# EAGLE schematic dt-rev-b (EAGLE 9.6.2)

## Sheet 1 of 4
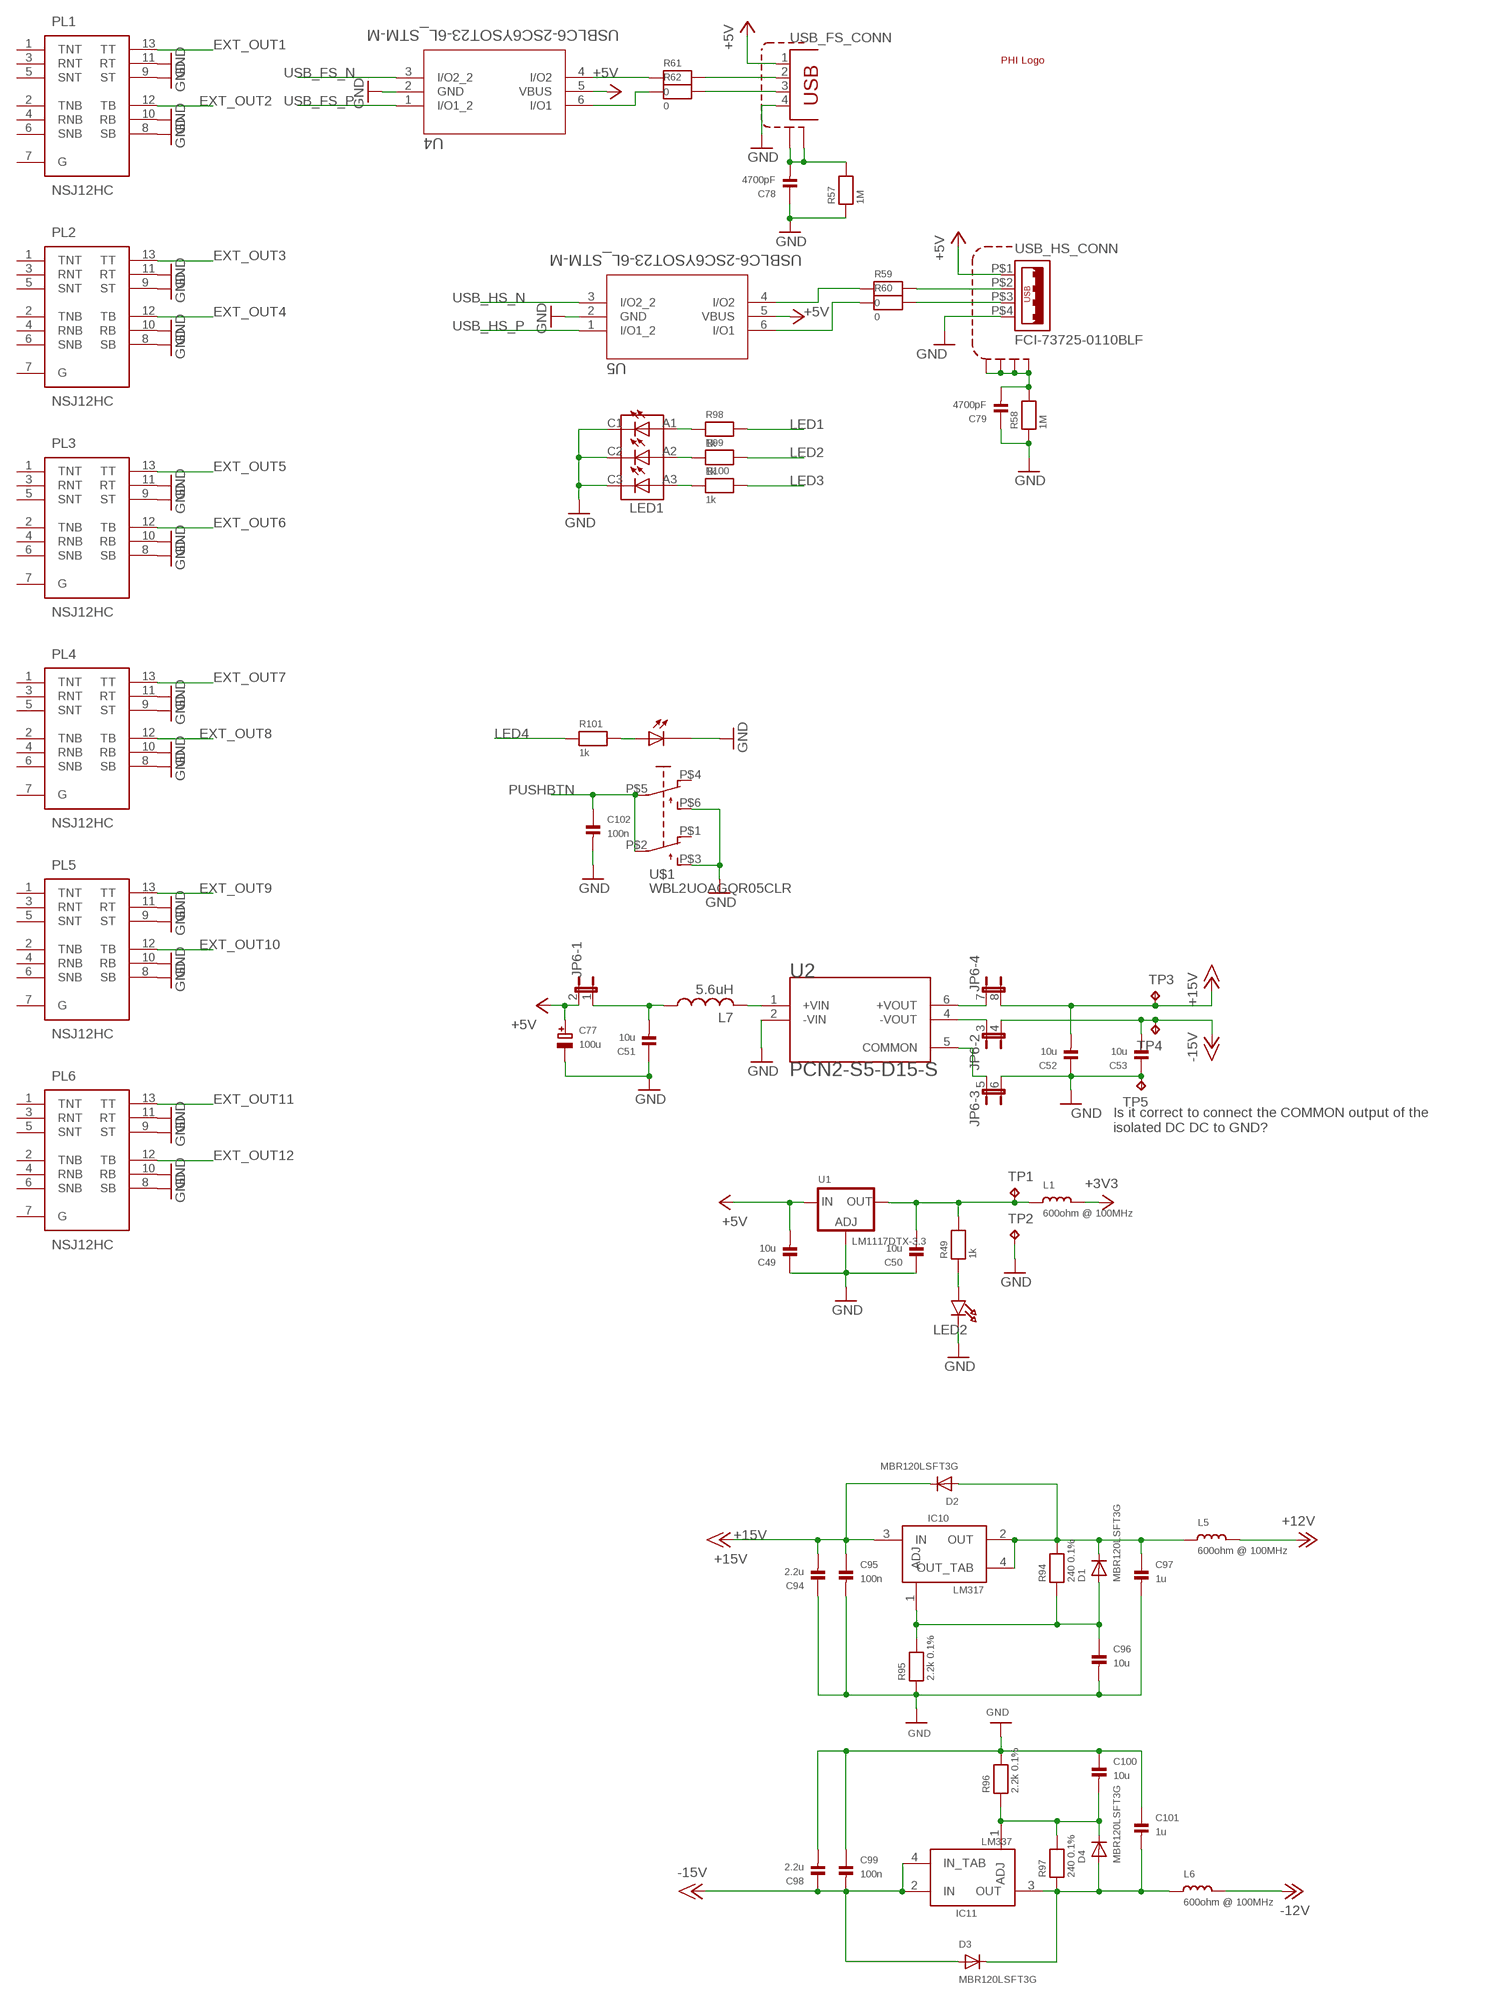
[diagram p0: schematic, sheet 1]

### Parts
C49  10u  CAP_CERAMIC0805  [0805]
C50  10u  CAP_CERAMIC0805  [0805]
C51  10u  CAP_CERAMIC0805  [0805]
C52  10u  CAP_CERAMIC0805  [0805]
C53  10u  CAP_CERAMIC0805  [0805]
C77  100u  CAP_ELECTROLYTICPANASONIC_D  [PANASONIC_D]
C78  4700pF  CAP_CERAMIC0603  [0603]
C79  4700pF  CAP_CERAMIC0603  [0603]
C94  2.2u  CAP_CERAMIC0805  [0805]
C95  100n  CAP_CERAMIC0603  [0603]
C96  10u  CAP_CERAMIC0805  [0805]
C97  1u  CAP_CERAMIC1206  [1206]
C98  2.2u  CAP_CERAMIC0805  [0805]
C99  100n  CAP_CERAMIC0603  [0603]
C100  10u  CAP_CERAMIC0805  [0805]
C101  1u  CAP_CERAMIC1206  [1206]
C102  100n  CAP_CERAMIC0603  [0603]
D1  MBR120LSFT3G  DIODESOD-123  [SOD-123]
D2  MBR120LSFT3G  DIODESOD-123  [SOD-123]
D3  MBR120LSFT3G  DIODESOD-123  [SOD-123]
D4  MBR120LSFT3G  DIODESOD-123  [SOD-123]
IC10  LM317  [SOT223]
IC11  LM337  [SOT223]
JP6  JP4QE  [JP4Q]
L1  600ohm @ 100MHz  INDUCTOR0603  [0603]
L5  600ohm @ 100MHz  INDUCTOR0603  [0603]
L6  600ohm @ 100MHz  INDUCTOR0603  [0603]
L7  5.6uH  L-USL1812  [L1812]
LED1  WP934SA_LILYLGDLED  [WP934SALILYLGD]
LED2  LED0805  [CHIPLED_0805]
PL1  NSJ12HC  NSJ12HF-1  [NSJ12HF1]
PL2  NSJ12HC  NSJ12HF-1  [NSJ12HF1]
PL3  NSJ12HC  NSJ12HF-1  [NSJ12HF1]
PL4  NSJ12HC  NSJ12HF-1  [NSJ12HF1]
PL5  NSJ12HC  NSJ12HF-1  [NSJ12HF1]
PL6  NSJ12HC  NSJ12HF-1  [NSJ12HF1]
R49  1k  RESISTOR0603  [0603]
R57  1M  RESISTOR0603  [0603]
R58  1M  RESISTOR0603  [0603]
R59  0  RESISTOR0603  [0603]
R60  0  RESISTOR0603  [0603]
R61  0  RESISTOR0603  [0603]
R62  0  RESISTOR0603  [0603]
R94  240 0.1%  RESISTOR0603  [0603]
R95  2.2k 0.1%  RESISTOR0603  [0603]
R96  2.2k 0.1%  RESISTOR0603  [0603]
R97  240 0.1%  RESISTOR0603  [0603]
R98  1k  RESISTOR0603  [0603]
R99  1k  RESISTOR0603  [0603]
R100  1k  RESISTOR0603  [0603]
R101  1k  RESISTOR0603  [0603]
TP1  TPPAD1-13  [P1-13]
TP2  TPPAD1-13  [P1-13]
TP3  TPPAD1-13  [P1-13]
TP4  TPPAD1-13  [P1-13]
TP5  TPPAD1-13  [P1-13]
U1  LM1117DTX-3.3  LM1117TO252  [TO252]
U2  PCN2-S5-D15-S  PCN2-S5-D12-S  [CONV_PCN2-S5-D12-S]
U4  USBLC6-2SC6YSOT23-6L_STM-M  [SOT23-6L_STM-M]
U5  USBLC6-2SC6YSOT23-6L_STM-M  [SOT23-6L_STM-M]
U$1  WBL2UOAGQR05CLR  [WBL2UOAGQ]
U$2  PHI-LOGO  [PHI-LOGO]
USB_FS  TE-292304-1  [TE-292304-1]
USB_HS  FCI-73725-0110BLF  [FCI-73725-0110BLF]

### Nets
+3V3: L1.2 ; also sheet 3,4
+5V: C49.2 C77.+ JP6.2 U1.2(IN) U4.5(VBUS) U5.5(VBUS) USB_FS.1 USB_HS.P$1 ; also sheet 3,4
+12V: L5.2 ; also sheet 2
+15V: C52.2 C94.2 C95.1 D2.C IC10.3(IN) JP6.8 TP3.TP
-12V: L6.2 ; also sheet 2
-15V: C53.2 C98.1 C99.2 D3.A IC11.2(IN) IC11.4(IN_TAB) JP6.4 TP4.TP
EXT_OUT1: PL1.13(TT) ; also sheet 2
EXT_OUT2: PL1.12(TB) ; also sheet 2
EXT_OUT3: PL2.13(TT) ; also sheet 2
EXT_OUT4: PL2.12(TB) ; also sheet 2
EXT_OUT5: PL3.13(TT) ; also sheet 2
EXT_OUT6: PL3.12(TB) ; also sheet 2
EXT_OUT7: PL4.13(TT) ; also sheet 2
EXT_OUT8: PL4.12(TB) ; also sheet 2
EXT_OUT9: PL5.13(TT) ; also sheet 2
EXT_OUT10: PL5.12(TB) ; also sheet 2
EXT_OUT11: PL6.13(TT) ; also sheet 2
EXT_OUT12: PL6.12(TB) ; also sheet 2
GND: C49.1 C50.1 C51.1 C52.1 C53.1 C77.- C78.1 C79.1 C94.1 C95.2 C96.2 C97.2 C98.2 C99.1 C100.1 C101.1 C102.2 JP6.6 LED1.C1(K_1) LED1.C2(K_2) LED1.C3(K_3) LED2.C PL1.8(SB) PL1.9(ST) PL1.10(RB) PL1.11(RT) PL2.8(SB) PL2.9(ST) PL2.10(RB) PL2.11(RT) PL3.8(SB) PL3.9(ST) PL3.10(RB) PL3.11(RT) PL4.8(SB) PL4.9(ST) PL4.10(RB) PL4.11(RT) PL5.8(SB) PL5.9(ST) PL5.10(RB) PL5.11(RT) PL6.8(SB) PL6.9(ST) PL6.10(RB) PL6.11(RT) R57.1 R58.1 R95.1 R96.2 TP2.TP TP5.TP U1.1(ADJ) U2.2(-VIN) U4.2(GND) U5.2(GND) U$1.LED- U$1.P$3(OUT1_NO) U$1.P$6(OUT2_NO) USB_FS.4 USB_HS.P$4 ; also sheet 2,3,4
LED1: R98.2 ; also sheet 3
LED2: R99.2 ; also sheet 3
LED3: R100.2 ; also sheet 3
LED4: R101.1 ; also sheet 3
N$49: LED2.A R49.1
N$50: C50.2 L1.1 R49.2 TP1.TP U1.3(OUT)
N$52: L7.2 U2.1(+VIN)
N$53: JP6.5 U2.5(COMMON)
N$54: JP6.7 U2.6(+VOUT)
N$55: JP6.3 U2.4(-VOUT)
N$56: C51.2 JP6.1 L7.1
N$67: C78.2 R57.2 USB_FS.P$1(SHIELD:S1) USB_FS.P$2(SHIELD:S2)
N$69: C79.2 R58.2 USB_HS.M1(SHIELD:S1) USB_HS.M2(SHIELD:S2) USB_HS.M3(SHIELD:S3) USB_HS.M4(SHIELD:S4)
N$72: C97.1 D1.C D2.A IC10.2(OUT) IC10.4(OUT_TAB) L5.1 R94.2
N$73: C96.1 D1.A IC10.1(ADJ) R94.1 R95.2
N$87: C101.2 D3.C D4.A IC11.3(OUT) L6.1 R97.1
N$88: C100.2 D4.C IC11.1(ADJ) R96.1 R97.2
N$96: LED1.A2(A_2) R99.1
N$119: LED1.A3(A_3) R100.1
N$120: LED1.A1(A_1) R98.1
N$121: R101.2 U$1.LED+
PUSHBTN: C102.1 U$1.P$2(IN1) U$1.P$5(IN2) ; also sheet 3
USB_DEV_CONN_N [USB]: R61.2 USB_FS.2
USB_DEV_CONN_P [USB]: R62.2 USB_FS.3
USB_DEV_N [USB]: R61.1 U4.4(I/O2)
USB_DEV_P [USB]: R62.1 U4.6(I/O1)
USB_FS_N [USB]: U4.3(I/O2_2) ; also sheet 3
USB_FS_P [USB]: U4.1(I/O1_2) ; also sheet 3
USB_HOST_CONN_N [USB]: R59.2 USB_HS.P$2
USB_HOST_CONN_P [USB]: R60.2 USB_HS.P$3
USB_HOST_N [USB]: R59.1 U5.4(I/O2)
USB_HOST_P [USB]: R60.1 U5.6(I/O1)
USB_HS_N [USB]: U5.3(I/O2_2) ; also sheet 3
USB_HS_P [USB]: U5.1(I/O1_2) ; also sheet 3
Unconnected: PL1.1(TNT) PL1.2(TNB) PL1.3(RNT) PL1.4(RNB) PL1.5(SNT) PL1.6(SNB) PL1.7(G) PL2.1(TNT) PL2.2(TNB) PL2.3(RNT) PL2.4(RNB) PL2.5(SNT) PL2.6(SNB) PL2.7(G) PL3.1(TNT) PL3.2(TNB) PL3.3(RNT) PL3.4(RNB) PL3.5(SNT) PL3.6(SNB) PL3.7(G) PL4.1(TNT) PL4.2(TNB) PL4.3(RNT) PL4.4(RNB) PL4.5(SNT) PL4.6(SNB) PL4.7(G) PL5.1(TNT) PL5.2(TNB) PL5.3(RNT) PL5.4(RNB) PL5.5(SNT) PL5.6(SNB) PL5.7(G) PL6.1(TNT) PL6.2(TNB) PL6.3(RNT) PL6.4(RNB) PL6.5(SNT) PL6.6(SNB) PL6.7(G) U$1.P$1(OUT1_NC) U$1.P$4(OUT2_NC)

### Notes on the sheet
- Is it correct to connect the COMMON output of the
  isolated DC DC to GND?

## Sheet 2 of 4
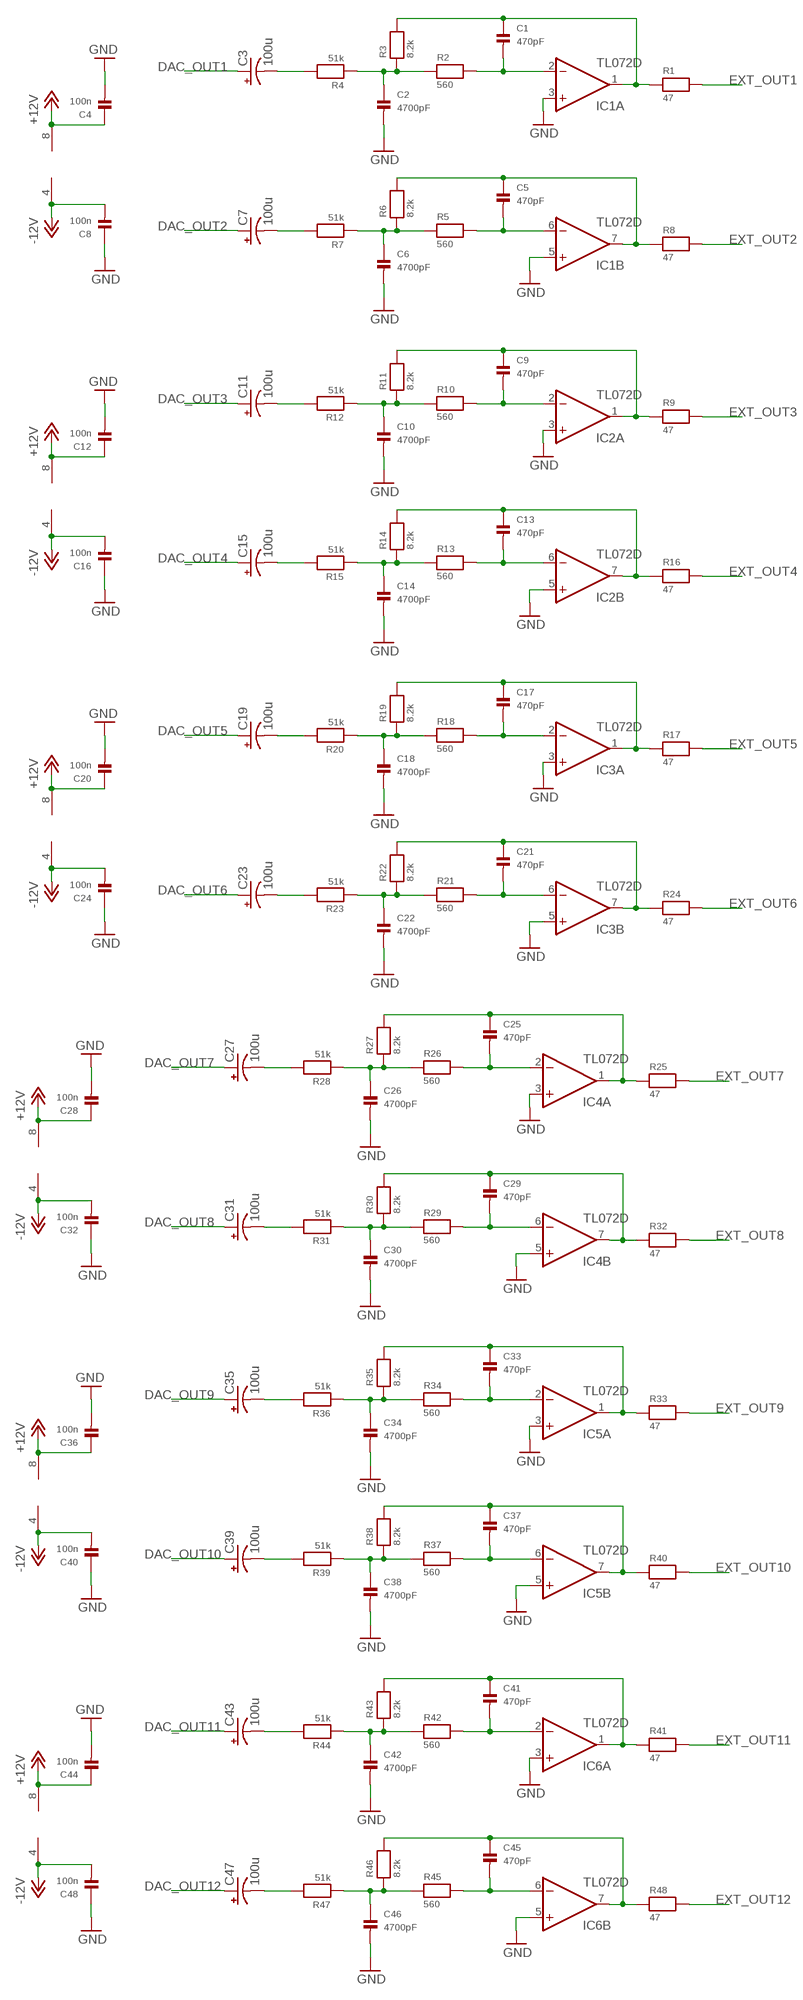
[diagram p1: schematic, sheet 2]

### Parts
C1  470pF  CAP_CERAMIC0603  [0603]
C2  4700pF  CAP_CERAMIC0603  [0603]
C3  100u  CPOL-USE2-5  [E2-5]
C4  100n  CAP_CERAMIC0603  [0603]
C5  470pF  CAP_CERAMIC0603  [0603]
C6  4700pF  CAP_CERAMIC0603  [0603]
C7  100u  CPOL-USE2-5  [E2-5]
C8  100n  CAP_CERAMIC0603  [0603]
C9  470pF  CAP_CERAMIC0603  [0603]
C10  4700pF  CAP_CERAMIC0603  [0603]
C11  100u  CPOL-USE2-5  [E2-5]
C12  100n  CAP_CERAMIC0603  [0603]
C13  470pF  CAP_CERAMIC0603  [0603]
C14  4700pF  CAP_CERAMIC0603  [0603]
C15  100u  CPOL-USE2-5  [E2-5]
C16  100n  CAP_CERAMIC0603  [0603]
C17  470pF  CAP_CERAMIC0603  [0603]
C18  4700pF  CAP_CERAMIC0603  [0603]
C19  100u  CPOL-USE2-5  [E2-5]
C20  100n  CAP_CERAMIC0603  [0603]
C21  470pF  CAP_CERAMIC0603  [0603]
C22  4700pF  CAP_CERAMIC0603  [0603]
C23  100u  CPOL-USE2-5  [E2-5]
C24  100n  CAP_CERAMIC0603  [0603]
C25  470pF  CAP_CERAMIC0603  [0603]
C26  4700pF  CAP_CERAMIC0603  [0603]
C27  100u  CPOL-USE2-5  [E2-5]
C28  100n  CAP_CERAMIC0603  [0603]
C29  470pF  CAP_CERAMIC0603  [0603]
C30  4700pF  CAP_CERAMIC0603  [0603]
C31  100u  CPOL-USE2-5  [E2-5]
C32  100n  CAP_CERAMIC0603  [0603]
C33  470pF  CAP_CERAMIC0603  [0603]
C34  4700pF  CAP_CERAMIC0603  [0603]
C35  100u  CPOL-USE2-5  [E2-5]
C36  100n  CAP_CERAMIC0603  [0603]
C37  470pF  CAP_CERAMIC0603  [0603]
C38  4700pF  CAP_CERAMIC0603  [0603]
C39  100u  CPOL-USE2-5  [E2-5]
C40  100n  CAP_CERAMIC0603  [0603]
C41  470pF  CAP_CERAMIC0603  [0603]
C42  4700pF  CAP_CERAMIC0603  [0603]
C43  100u  CPOL-USE2-5  [E2-5]
C44  100n  CAP_CERAMIC0603  [0603]
C45  470pF  CAP_CERAMIC0603  [0603]
C46  4700pF  CAP_CERAMIC0603  [0603]
C47  100u  CPOL-USE2-5  [E2-5]
C48  100n  CAP_CERAMIC0603  [0603]
IC1  TL072D  [SO08]
IC2  TL072D  [SO08]
IC3  TL072D  [SO08]
IC4  TL072D  [SO08]
IC5  TL072D  [SO08]
IC6  TL072D  [SO08]
R1  47  RESISTOR0603  [0603]
R2  560  RESISTOR0603  [0603]
R3  8.2k  RESISTOR0603  [0603]
R4  51k  RESISTOR0603  [0603]
R5  560  RESISTOR0603  [0603]
R6  8.2k  RESISTOR0603  [0603]
R7  51k  RESISTOR0603  [0603]
R8  47  RESISTOR0603  [0603]
R9  47  RESISTOR0603  [0603]
R10  560  RESISTOR0603  [0603]
R11  8.2k  RESISTOR0603  [0603]
R12  51k  RESISTOR0603  [0603]
R13  560  RESISTOR0603  [0603]
R14  8.2k  RESISTOR0603  [0603]
R15  51k  RESISTOR0603  [0603]
R16  47  RESISTOR0603  [0603]
R17  47  RESISTOR0603  [0603]
R18  560  RESISTOR0603  [0603]
R19  8.2k  RESISTOR0603  [0603]
R20  51k  RESISTOR0603  [0603]
R21  560  RESISTOR0603  [0603]
R22  8.2k  RESISTOR0603  [0603]
R23  51k  RESISTOR0603  [0603]
R24  47  RESISTOR0603  [0603]
R25  47  RESISTOR0603  [0603]
R26  560  RESISTOR0603  [0603]
R27  8.2k  RESISTOR0603  [0603]
R28  51k  RESISTOR0603  [0603]
R29  560  RESISTOR0603  [0603]
R30  8.2k  RESISTOR0603  [0603]
R31  51k  RESISTOR0603  [0603]
R32  47  RESISTOR0603  [0603]
R33  47  RESISTOR0603  [0603]
R34  560  RESISTOR0603  [0603]
R35  8.2k  RESISTOR0603  [0603]
R36  51k  RESISTOR0603  [0603]
R37  560  RESISTOR0603  [0603]
R38  8.2k  RESISTOR0603  [0603]
R39  51k  RESISTOR0603  [0603]
R40  47  RESISTOR0603  [0603]
R41  47  RESISTOR0603  [0603]
R42  560  RESISTOR0603  [0603]
R43  8.2k  RESISTOR0603  [0603]
R44  51k  RESISTOR0603  [0603]
R45  560  RESISTOR0603  [0603]
R46  8.2k  RESISTOR0603  [0603]
R47  51k  RESISTOR0603  [0603]
R48  47  RESISTOR0603  [0603]

### Nets
+12V: C4.1 C12.1 C20.1 C28.1 C36.1 C44.1 IC1.8(P:V+) IC2.8(P:V+) IC3.8(P:V+) IC4.8(P:V+) IC5.8(P:V+) IC6.8(P:V+) ; also sheet 1
-12V: C8.2 C16.2 C24.2 C32.2 C40.2 C48.2 IC1.4(P:V-) IC2.4(P:V-) IC3.4(P:V-) IC4.4(P:V-) IC5.4(P:V-) IC6.4(P:V-) ; also sheet 1
DAC_OUT1: C3.+ ; also sheet 4
DAC_OUT2: C7.+ ; also sheet 4
DAC_OUT3: C11.+ ; also sheet 4
DAC_OUT4: C15.+ ; also sheet 4
DAC_OUT5: C19.+ ; also sheet 4
DAC_OUT6: C23.+ ; also sheet 4
DAC_OUT7: C27.+ ; also sheet 4
DAC_OUT8: C31.+ ; also sheet 4
DAC_OUT9: C35.+ ; also sheet 4
DAC_OUT10: C39.+ ; also sheet 4
DAC_OUT11: C43.+ ; also sheet 4
DAC_OUT12: C47.+ ; also sheet 4
EXT_OUT1: R1.2 ; also sheet 1
EXT_OUT2: R8.2 ; also sheet 1
EXT_OUT3: R9.2 ; also sheet 1
EXT_OUT4: R16.2 ; also sheet 1
EXT_OUT5: R17.2 ; also sheet 1
EXT_OUT6: R24.2 ; also sheet 1
EXT_OUT7: R25.2 ; also sheet 1
EXT_OUT8: R32.2 ; also sheet 1
EXT_OUT9: R33.2 ; also sheet 1
EXT_OUT10: R40.2 ; also sheet 1
EXT_OUT11: R41.2 ; also sheet 1
EXT_OUT12: R48.2 ; also sheet 1
GND: C2.2 C4.2 C6.2 C8.1 C10.2 C12.2 C14.2 C16.1 C18.2 C20.2 C22.2 C24.1 C26.2 C28.2 C30.2 C32.1 C34.2 C36.2 C38.2 C40.1 C42.2 C44.2 C46.2 C48.1 IC1.3(A:+IN) IC1.5(B:+IN) IC2.3(A:+IN) IC2.5(B:+IN) IC3.3(A:+IN) IC3.5(B:+IN) IC4.3(A:+IN) IC4.5(B:+IN) IC5.3(A:+IN) IC5.5(B:+IN) IC6.3(A:+IN) IC6.5(B:+IN) ; also sheet 1,3,4
N$1: C1.2 IC1.2(A:-IN) R2.2
N$2: C1.1 IC1.1(A:OUT) R1.1 R3.2
N$3: C2.1 R2.1 R3.1 R4.1
N$4: C3.- R4.2
N$5: C5.2 IC1.6(B:-IN) R5.2
N$6: C5.1 IC1.7(B:OUT) R6.2 R8.1
N$7: C6.1 R5.1 R6.1 R7.1
N$8: C7.- R7.2
N$9: C9.2 IC2.2(A:-IN) R10.2
N$10: C9.1 IC2.1(A:OUT) R9.1 R11.2
N$11: C10.1 R10.1 R11.1 R12.1
N$12: C11.- R12.2
N$13: C13.2 IC2.6(B:-IN) R13.2
N$14: C13.1 IC2.7(B:OUT) R14.2 R16.1
N$15: C14.1 R13.1 R14.1 R15.1
N$16: C15.- R15.2
N$17: C17.2 IC3.2(A:-IN) R18.2
N$18: C17.1 IC3.1(A:OUT) R17.1 R19.2
N$19: C18.1 R18.1 R19.1 R20.1
N$20: C19.- R20.2
N$21: C21.2 IC3.6(B:-IN) R21.2
N$22: C21.1 IC3.7(B:OUT) R22.2 R24.1
N$23: C22.1 R21.1 R22.1 R23.1
N$24: C23.- R23.2
N$25: C25.2 IC4.2(A:-IN) R26.2
N$26: C25.1 IC4.1(A:OUT) R25.1 R27.2
N$27: C26.1 R26.1 R27.1 R28.1
N$28: C27.- R28.2
N$29: C29.2 IC4.6(B:-IN) R29.2
N$30: C29.1 IC4.7(B:OUT) R30.2 R32.1
N$31: C30.1 R29.1 R30.1 R31.1
N$32: C31.- R31.2
N$33: C33.2 IC5.2(A:-IN) R34.2
N$34: C33.1 IC5.1(A:OUT) R33.1 R35.2
N$35: C34.1 R34.1 R35.1 R36.1
N$36: C35.- R36.2
N$37: C37.2 IC5.6(B:-IN) R37.2
N$38: C37.1 IC5.7(B:OUT) R38.2 R40.1
N$39: C38.1 R37.1 R38.1 R39.1
N$40: C39.- R39.2
N$41: C41.2 IC6.2(A:-IN) R42.2
N$42: C41.1 IC6.1(A:OUT) R41.1 R43.2
N$43: C42.1 R42.1 R43.1 R44.1
N$44: C43.- R44.2
N$45: C45.2 IC6.6(B:-IN) R45.2
N$46: C45.1 IC6.7(B:OUT) R46.2 R48.1
N$47: C46.1 R45.1 R46.1 R47.1
N$48: C47.- R47.2

## Sheet 3 of 4
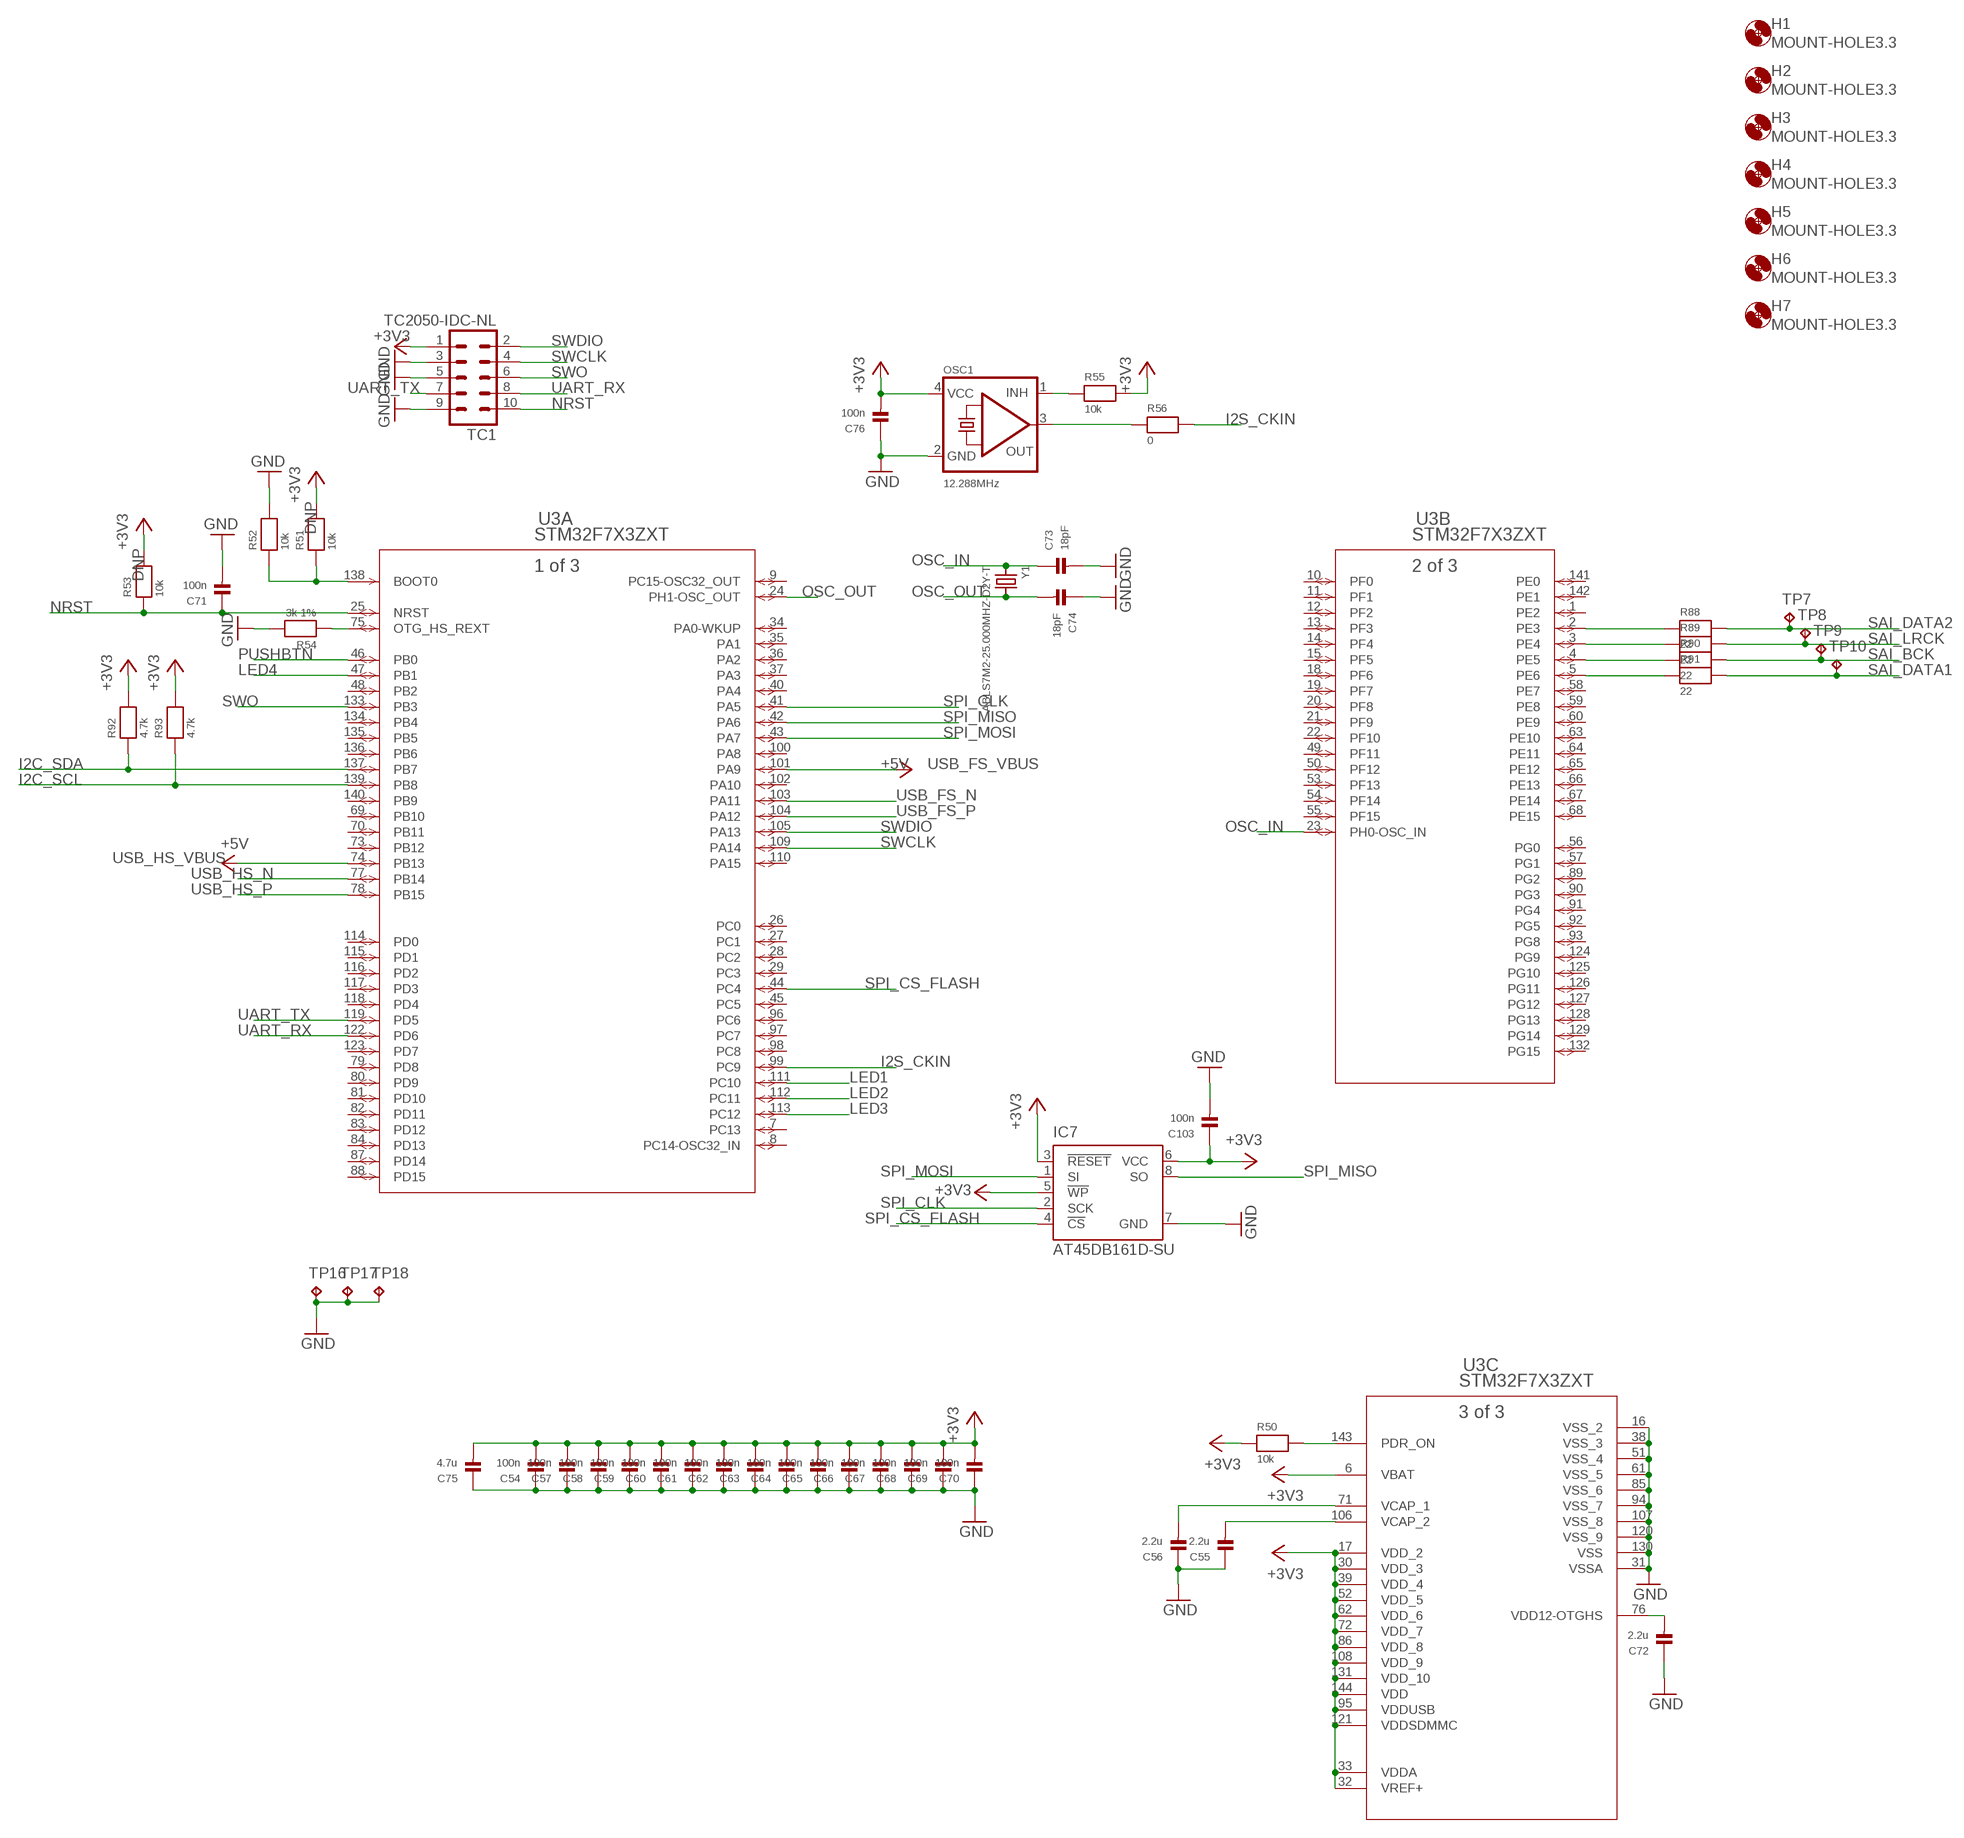
[diagram p2: schematic, sheet 3]

### Parts
C54  100n  CAP_CERAMIC0603  [0603]
C55  2.2u  CAP_CERAMIC1206  [1206]
C56  2.2u  CAP_CERAMIC1206  [1206]
C57  100n  CAP_CERAMIC0603  [0603]
C58  100n  CAP_CERAMIC0603  [0603]
C59  100n  CAP_CERAMIC0603  [0603]
C60  100n  CAP_CERAMIC0603  [0603]
C61  100n  CAP_CERAMIC0603  [0603]
C62  100n  CAP_CERAMIC0603  [0603]
C63  100n  CAP_CERAMIC0603  [0603]
C64  100n  CAP_CERAMIC0603  [0603]
C65  100n  CAP_CERAMIC0603  [0603]
C66  100n  CAP_CERAMIC0603  [0603]
C67  100n  CAP_CERAMIC0603  [0603]
C68  100n  CAP_CERAMIC0603  [0603]
C69  100n  CAP_CERAMIC0603  [0603]
C70  100n  CAP_CERAMIC0603  [0603]
C71  100n  CAP_CERAMIC0603  [0603]
C72  2.2u  CAP_CERAMIC1206  [1206]
C73  18pF  CAP_CERAMIC0603  [0603]
C74  18pF  CAP_CERAMIC0603  [0603]
C75  4.7u  CAP_CERAMIC0603  [0603]
C76  100n  CAP_CERAMIC0603  [0603]
C103  100n  CAP_CERAMIC0603  [0603]
H1  MOUNT-HOLE3.3  [3,3]
H2  MOUNT-HOLE3.3  [3,3]
H3  MOUNT-HOLE3.3  [3,3]
H4  MOUNT-HOLE3.3  [3,3]
H5  MOUNT-HOLE3.3  [3,3]
H6  MOUNT-HOLE3.3  [3,3]
H7  MOUNT-HOLE3.3  [3,3]
IC7  AT45DB161D-SU  [SOIC8]
OSC1  12.288MHz  OSCILLATOR  [OSC_7X5MM]
R50  10k  RESISTOR0603  [0603]
R51  10k  RESISTOR0603  [0603]
R52  10k  RESISTOR0603  [0603]
R53  10k  RESISTOR0603  [0603]
R54  3k 1%  RESISTOR0603  [0603]
R55  10k  RESISTOR0603  [0603]
R56  0  RESISTOR0603  [0603]
R88  22  RESISTOR0603  [0603]
R89  22  RESISTOR0603  [0603]
R90  22  RESISTOR0603  [0603]
R91  22  RESISTOR0603  [0603]
R92  4.7k  RESISTOR0603  [0603]
R93  4.7k  RESISTOR0603  [0603]
TC1  TC2050-IDC-NL  [TC2050-IDC-NL]
TP7  TPPAD1-13  [P1-13]
TP8  TPPAD1-13  [P1-13]
TP9  TPPAD1-13  [P1-13]
TP10  TPPAD1-13  [P1-13]
TP16  TPPAD1-13  [P1-13]
TP17  TPPAD1-13  [P1-13]
TP18  TPPAD1-13  [P1-13]
U3  STM32F7X3ZXT  [LQFP144-20X20MM]
Y1  ABLS7M2-25.000MHZ-D2Y-T  CRYSTALABLS7M2  [ABLS7M225000MHZD2YT]

### Nets
+3V3: C54.2 C57.2 C58.2 C59.2 C60.2 C61.2 C62.2 C63.2 C64.2 C65.2 C66.2 C67.2 C68.2 C69.2 C70.2 C75.2 C76.2 C103.1 IC7.3(!RESET) IC7.5(!WP) IC7.6(VCC) OSC1.4(VCC) R50.1 R51.2 R53.2 R55.2 R92.2 R93.2 TC1.1 U3.6(C:VBAT) U3.17(C:VDD_2) U3.30(C:VDD_3) U3.32(C:VREF+) U3.33(C:VDDA) U3.39(C:VDD_4) U3.52(C:VDD_5) U3.62(C:VDD_6) U3.72(C:VDD_7) U3.86(C:VDD_8) U3.95(C:VDDUSB) U3.108(C:VDD_9) U3.121(C:VDDSDMMC) U3.131(C:VDD_10) U3.144(C:VDD) ; also sheet 1,4
+5V: U3.74(A:PB13) U3.101(A:PA9) ; also sheet 1,4
GND: C54.1 C55.1 C56.1 C57.1 C58.1 C59.1 C60.1 C61.1 C62.1 C63.1 C64.1 C65.1 C66.1 C67.1 C68.1 C69.1 C70.1 C71.2 C72.1 C73.2 C74.1 C75.1 C76.1 C103.2 IC7.7(GND) OSC1.2(GND) R52.2 R54.2 TC1.3 TC1.5 TC1.9 TP16.TP TP17.TP TP18.TP U3.16(C:VSS_2) U3.31(C:VSSA) U3.38(C:VSS_3) U3.51(C:VSS_4) U3.61(C:VSS_5) U3.85(C:VSS_6) U3.94(C:VSS_7) U3.107(C:VSS_8) U3.120(C:VSS_9) U3.130(C:VSS) ; also sheet 1,2,4
I2C_SCL: R93.1 U3.139(A:PB8) ; also sheet 4
I2C_SDA: R92.1 U3.137(A:PB7) ; also sheet 4
I2S_CKIN: R56.2 U3.99(A:PC9)
LED1: U3.111(A:PC10) ; also sheet 1
LED2: U3.112(A:PC11) ; also sheet 1
LED3: U3.113(A:PC12) ; also sheet 1
LED4: U3.47(A:PB1) ; also sheet 1
N$57: C56.2 U3.71(C:VCAP_1)
N$58: C55.2 U3.106(C:VCAP_2)
N$59: R50.2 U3.143(C:PDR_ON)
N$60: R51.1 R52.1 U3.138(A:BOOT0)
N$61: R54.1 U3.75(A:OTG_HS_REXT)
N$62: C72.2 U3.76(C:VDD12-OTGHS)
N$63: OSC1.1(INH) R55.1
N$64: OSC1.3(OUT) R56.1
N$66: R88.1 U3.2(B:PE3)
N$68: R89.1 U3.3(B:PE4)
N$70: R90.1 U3.4(B:PE5)
N$71: R91.1 U3.5(B:PE6)
NRST: C71.1 R53.1 TC1.10 U3.25(A:NRST)
OSC_IN: C73.1 U3.23(B:PH0-OSC_IN) Y1.1
OSC_OUT: C74.2 U3.24(A:PH1-OSC_OUT) Y1.2
PUSHBTN: U3.46(A:PB0) ; also sheet 1
SAI_BCK: R90.2 TP9.TP ; also sheet 4
SAI_DATA1: R91.2 TP10.TP ; also sheet 4
SAI_DATA2: R88.2 TP7.TP ; also sheet 4
SAI_LRCK: R89.2 TP8.TP ; also sheet 4
SPI_CLK: IC7.2(SCK) U3.41(A:PA5)
SPI_CS_FLASH: IC7.4(!CS) U3.44(A:PC4)
SPI_MISO: IC7.8(SO) U3.42(A:PA6)
SPI_MOSI: IC7.1(SI) U3.43(A:PA7)
SWCLK: TC1.4 U3.109(A:PA14)
SWDIO: TC1.2 U3.105(A:PA13)
SWO: TC1.6 U3.133(A:PB3)
UART_RX: TC1.8 U3.122(A:PD6)
UART_TX: TC1.7 U3.119(A:PD5)
USB_FS_N [USB]: U3.103(A:PA11) ; also sheet 1
USB_FS_P [USB]: U3.104(A:PA12) ; also sheet 1
USB_HS_N [USB]: U3.77(A:PB14) ; also sheet 1
USB_HS_P [USB]: U3.78(A:PB15) ; also sheet 1
Unconnected: U3.1(B:PE2) U3.7(A:PC13) U3.8(A:PC14-OSC32_IN) U3.9(A:PC15-OSC32_OUT) U3.10(B:PF0) U3.11(B:PF1) U3.12(B:PF2) U3.13(B:PF3) U3.14(B:PF4) U3.15(B:PF5) U3.18(B:PF6) U3.19(B:PF7) U3.20(B:PF8) U3.21(B:PF9) U3.22(B:PF10) U3.26(A:PC0) U3.27(A:PC1) U3.28(A:PC2) U3.29(A:PC3) U3.34(A:PA0-WKUP) U3.35(A:PA1) U3.36(A:PA2) U3.37(A:PA3) U3.40(A:PA4) U3.45(A:PC5) U3.48(A:PB2) U3.49(B:PF11) U3.50(B:PF12) U3.53(B:PF13) U3.54(B:PF14) U3.55(B:PF15) U3.56(B:PG0) U3.57(B:PG1) U3.58(B:PE7) U3.59(B:PE8) U3.60(B:PE9) U3.63(B:PE10) U3.64(B:PE11) U3.65(B:PE12) U3.66(B:PE13) U3.67(B:PE14) U3.68(B:PE15) U3.69(A:PB10) U3.70(A:PB11) U3.73(A:PB12) U3.79(A:PD8) U3.80(A:PD9) U3.81(A:PD10) U3.82(A:PD11) U3.83(A:PD12) U3.84(A:PD13) U3.87(A:PD14) U3.88(A:PD15) U3.89(B:PG2) U3.90(B:PG3) U3.91(B:PG4) U3.92(B:PG5) U3.93(B:PG8) U3.96(A:PC6) U3.97(A:PC7) U3.98(A:PC8) U3.100(A:PA8) U3.102(A:PA10) U3.110(A:PA15) U3.114(A:PD0) U3.115(A:PD1) U3.116(A:PD2) U3.117(A:PD3) U3.118(A:PD4) U3.123(A:PD7) U3.124(B:PG9) U3.125(B:PG10) U3.126(B:PG11) U3.127(B:PG12) U3.128(B:PG13) U3.129(B:PG14) U3.132(B:PG15) U3.134(A:PB4) U3.135(A:PB5) U3.136(A:PB6) U3.140(A:PB9) U3.141(B:PE0) U3.142(B:PE1)

### Notes on the sheet
- USB_FS_VBUS
- USB_HS_VBUS

## Sheet 4 of 4
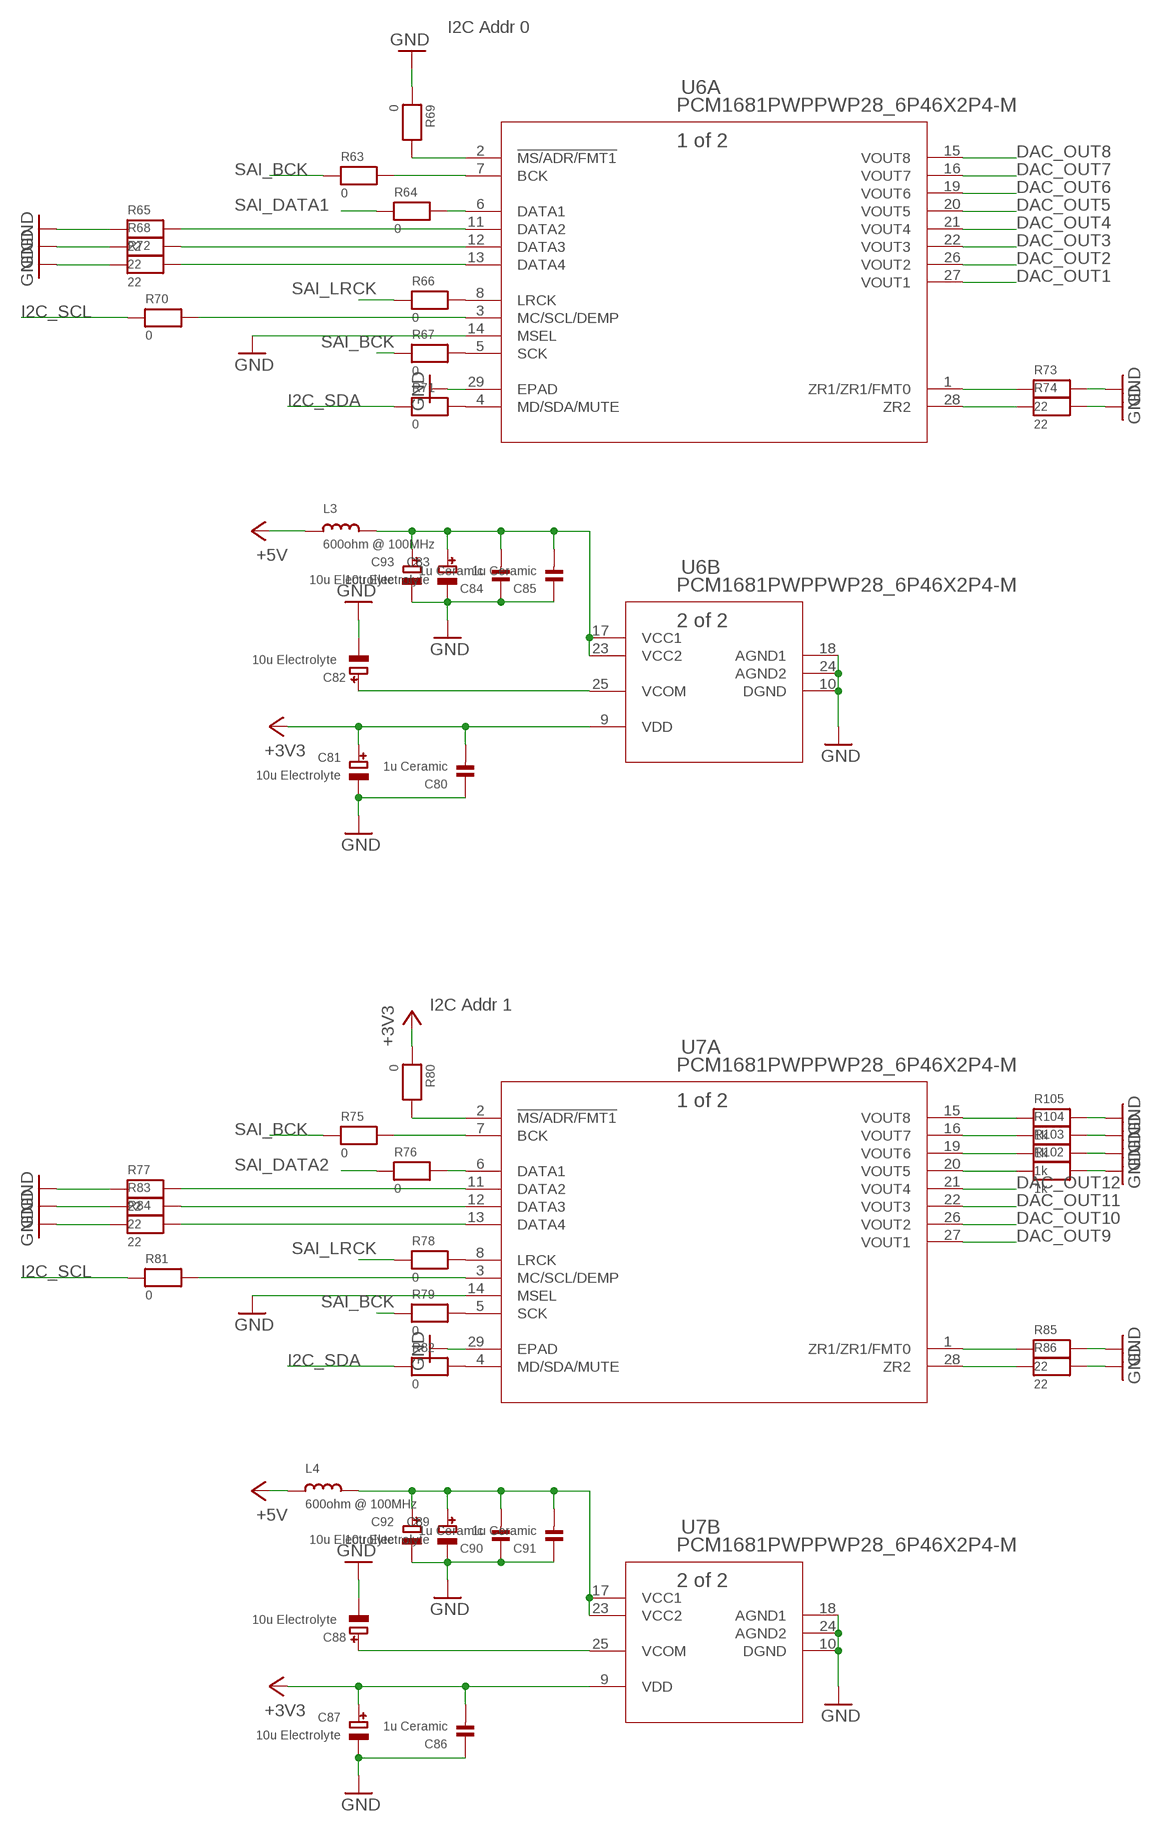
[diagram p3: schematic, sheet 4]

### Parts
C80  1u Ceramic  CAP_CERAMIC0603  [0603]
C81  10u Electrolyte  CAP_ELECTROLYTICPANASONIC_C  [PANASONIC_C]
C82  10u Electrolyte  CAP_ELECTROLYTICPANASONIC_C  [PANASONIC_C]
C83  10u Electrolyte  CAP_ELECTROLYTICPANASONIC_C  [PANASONIC_C]
C84  1u Ceramic  CAP_CERAMIC0603  [0603]
C85  1u Ceramic  CAP_CERAMIC0603  [0603]
C86  1u Ceramic  CAP_CERAMIC0603  [0603]
C87  10u Electrolyte  CAP_ELECTROLYTICPANASONIC_C  [PANASONIC_C]
C88  10u Electrolyte  CAP_ELECTROLYTICPANASONIC_C  [PANASONIC_C]
C89  10u Electrolyte  CAP_ELECTROLYTICPANASONIC_C  [PANASONIC_C]
C90  1u Ceramic  CAP_CERAMIC0603  [0603]
C91  1u Ceramic  CAP_CERAMIC0603  [0603]
C92  10u Electrolyte  CAP_ELECTROLYTICPANASONIC_C  [PANASONIC_C]
C93  10u Electrolyte  CAP_ELECTROLYTICPANASONIC_C  [PANASONIC_C]
L3  600ohm @ 100MHz  INDUCTOR0603  [0603]
L4  600ohm @ 100MHz  INDUCTOR0603  [0603]
R63  0  RESISTOR0603  [0603]
R64  0  RESISTOR0603  [0603]
R65  22  RESISTOR0603  [0603]
R66  0  RESISTOR0603  [0603]
R67  0  RESISTOR0603  [0603]
R68  22  RESISTOR0603  [0603]
R69  0  RESISTOR0603  [0603]
R70  0  RESISTOR0603  [0603]
R71  0  RESISTOR0603  [0603]
R72  22  RESISTOR0603  [0603]
R73  22  RESISTOR0603  [0603]
R74  22  RESISTOR0603  [0603]
R75  0  RESISTOR0603  [0603]
R76  0  RESISTOR0603  [0603]
R77  22  RESISTOR0603  [0603]
R78  0  RESISTOR0603  [0603]
R79  0  RESISTOR0603  [0603]
R80  0  RESISTOR0603  [0603]
R81  0  RESISTOR0603  [0603]
R82  0  RESISTOR0603  [0603]
R83  22  RESISTOR0603  [0603]
R84  22  RESISTOR0603  [0603]
R85  22  RESISTOR0603  [0603]
R86  22  RESISTOR0603  [0603]
R102  1k  RESISTOR0603  [0603]
R103  1k  RESISTOR0603  [0603]
R104  1k  RESISTOR0603  [0603]
R105  1k  RESISTOR0603  [0603]
U6  PCM1681PWPPWP28_6P46X2P4-M  [PWP28_6P46X2P4-M]
U7  PCM1681PWPPWP28_6P46X2P4-M  [PWP28_6P46X2P4-M]

### Nets
+3V3: C80.2 C81.+ C86.2 C87.+ R80.1 U6.9(B:VDD) U7.9(B:VDD) ; also sheet 1,3
+5V: L3.1 L4.1 ; also sheet 1,3
DAC_OUT1: U6.27(A:VOUT1) ; also sheet 2
DAC_OUT2: U6.26(A:VOUT2) ; also sheet 2
DAC_OUT3: U6.22(A:VOUT3) ; also sheet 2
DAC_OUT4: U6.21(A:VOUT4) ; also sheet 2
DAC_OUT5: U6.20(A:VOUT5) ; also sheet 2
DAC_OUT6: U6.19(A:VOUT6) ; also sheet 2
DAC_OUT7: U6.16(A:VOUT7) ; also sheet 2
DAC_OUT8: U6.15(A:VOUT8) ; also sheet 2
DAC_OUT9: U7.27(A:VOUT1) ; also sheet 2
DAC_OUT10: U7.26(A:VOUT2) ; also sheet 2
DAC_OUT11: U7.22(A:VOUT3) ; also sheet 2
DAC_OUT12: U7.21(A:VOUT4) ; also sheet 2
GND: C80.1 C81.- C82.- C83.- C84.1 C85.1 C86.1 C87.- C88.- C89.- C90.1 C91.1 C92.- C93.- R65.1 R68.1 R69.1 R72.1 R73.2 R74.2 R77.1 R83.1 R84.1 R85.2 R86.2 R102.2 R103.2 R104.2 R105.2 U6.10(B:DGND) U6.14(A:MSEL) U6.18(B:AGND1) U6.24(B:AGND2) U6.29(A:EPAD) U7.10(B:DGND) U7.14(A:MSEL) U7.18(B:AGND1) U7.24(B:AGND2) U7.29(A:EPAD) ; also sheet 1,2,3
I2C_SCL: R70.1 R81.1 ; also sheet 3
I2C_SDA: R71.1 R82.1 ; also sheet 3
N$75: R73.1 U6.1(A:ZR1/ZR1/FMT0)
N$76: R74.1 U6.28(A:ZR2)
N$77: R69.2 U6.2(A:!MS/ADR/FMT1)
N$79: C82.+ U6.25(B:VCOM)
N$80: C83.+ C84.2 C85.2 C93.+ L3.2 U6.17(B:VCC1) U6.23(B:VCC2)
N$81: R63.2 U6.7(A:BCK)
N$82: R64.2 U6.6(A:DATA1)
N$83: R65.2 U6.11(A:DATA2)
N$84: R66.2 U6.8(A:LRCK)
N$85: R68.2 U6.12(A:DATA3)
N$86: R72.2 U6.13(A:DATA4)
N$89: R67.2 U6.5(A:SCK)
N$91: R70.2 U6.3(A:MC/SCL/DEMP)
N$92: R71.2 U6.4(A:MD/SDA/MUTE)
N$97: R102.1 U7.20(A:VOUT5)
N$98: R103.1 U7.19(A:VOUT6)
N$99: R104.1 U7.16(A:VOUT7)
N$100: R105.1 U7.15(A:VOUT8)
N$101: R85.1 U7.1(A:ZR1/ZR1/FMT0)
N$102: R86.1 U7.28(A:ZR2)
N$103: C88.+ U7.25(B:VCOM)
N$104: C89.+ C90.2 C91.2 C92.+ L4.2 U7.17(B:VCC1) U7.23(B:VCC2)
N$105: R75.2 U7.7(A:BCK)
N$106: R76.2 U7.6(A:DATA1)
N$107: R77.2 U7.11(A:DATA2)
N$108: R78.2 U7.8(A:LRCK)
N$109: R79.2 U7.5(A:SCK)
N$110: R80.2 U7.2(A:!MS/ADR/FMT1)
N$111: R81.2 U7.3(A:MC/SCL/DEMP)
N$112: R82.2 U7.4(A:MD/SDA/MUTE)
N$117: R83.2 U7.12(A:DATA3)
N$118: R84.2 U7.13(A:DATA4)
SAI_BCK: R63.1 R67.1 R75.1 R79.1 ; also sheet 3
SAI_DATA1: R64.1 ; also sheet 3
SAI_DATA2: R76.1 ; also sheet 3
SAI_LRCK: R66.1 R78.1 ; also sheet 3

### Notes on the sheet
- I2C Addr 0
- I2C Addr 1

## Library data of the parts
C1 C5 C9 C13 C17 C21 C25 C29 C33 C37 C41 C45 = keves-ng:CAP_CERAMIC: Ceramic Capacitors 0402 - 0402 Surface Mount Capacitors 16pF 50V 5% [Digikey: 445-4899-2-ND] 18pF 50V 5% [Digikey: 490-1281-2-ND] 22pF 50V 5% [Digikey: 490-1283-2-ND] 68pF 50V 5% [Digikey: 490-1289-2-ND] 0.1uF 10V 10% [Digikey: 490-1318-2-ND] 1.0uF 6.3V 10% [Digikey: 490-1320-2-ND] 0603 - 0603 Surface Mount Capacitors 16 pF 50V 5% [Digikey: 445-5051-2-ND] 22 pF 50V [Digikey: PCC220ACVTR-ND] 33 pF 50V 5% [Digikey: 490-1415-1-ND] 56pF 50V 5% [Digikey: 490-1421-1-ND] 220pF 50V 5% [Digikey: 445-1285-1-ND] 680 pF 50V 2200 pF 50V 5% C0G [Digikey: 445-1297-1-ND] 5600 pF 100V 5% X7R [Digikey: 478-3711-1-ND] 0.1 µF 25V 10% [Digikey: PCC2277TR-ND] 0.22 µF 16V 10% X7R [Digikey: 445-1318-1-ND] 1.0 µF 25V 10% [Digikey: 445-5146-2-ND] 0603 - RF Specific 3pF 250V +/-0.1pF RF [Digikey: 712-1347-1-ND] 18 pF 250V 5% [Digikey: 478-3505-1-ND or 712-1322-1-ND] 56 pF 250V 5% C0G RF [Digikey: 490-4867-1-ND] 68 pF 250V RF [Digikey: 490-4868-1-ND] 0805 - 0805 Surface Mount Capacitors 220 pF 250V 2% RF Ceramic Capacitor [Digikey: 712-1398-1-ND] 1000 pF 50V 2% NP0 Ceramic Capacitor [Digikey: 478-3760-1-ND] 0.1 µF 25V 10% Ceramic Capacitor [Digikey: PCC1828TR-ND] 1.0 µF 16V 10% Ceramic Capacitor[Digikey: 490-1691-2-ND] 10.0 µF 10V 10% Ceramic Capacitor[Digikey: 709-1228-1-ND] 10.0 uF 16V 10% Ceramic Capacitor [Digikey: 478-5165-2-ND] 47 uF 6.3V 20% Ceramic Capacitor [Digikey: 587-1779-1-ND or 399-5506-1-ND] 1206 - 1206 Surface Mount Capacitors 47uF 10V 20% Ceramic Capacitor [Digikey: 490-5528-1-ND or 399-5508-1-ND or 445-6010-1-ND] 100uF 6.3V -20%, +80% Y5V Ceramic Capacitor (Digikey: 490-4512-1-ND, Mouser: 81-GRM31CF50J107ZE1L); PARTNO: C0603C471J5GACTU
C2 C6 C10 C14 C18 C22 C26 C30 C34 C38 C42 C46 C78 C79 = keves-ng:CAP_CERAMIC: Ceramic Capacitors 0402 - 0402 Surface Mount Capacitors 16pF 50V 5% [Digikey: 445-4899-2-ND] 18pF 50V 5% [Digikey: 490-1281-2-ND] 22pF 50V 5% [Digikey: 490-1283-2-ND] 68pF 50V 5% [Digikey: 490-1289-2-ND] 0.1uF 10V 10% [Digikey: 490-1318-2-ND] 1.0uF 6.3V 10% [Digikey: 490-1320-2-ND] 0603 - 0603 Surface Mount Capacitors 16 pF 50V 5% [Digikey: 445-5051-2-ND] 22 pF 50V [Digikey: PCC220ACVTR-ND] 33 pF 50V 5% [Digikey: 490-1415-1-ND] 56pF 50V 5% [Digikey: 490-1421-1-ND] 220pF 50V 5% [Digikey: 445-1285-1-ND] 680 pF 50V 2200 pF 50V 5% C0G [Digikey: 445-1297-1-ND] 5600 pF 100V 5% X7R [Digikey: 478-3711-1-ND] 0.1 µF 25V 10% [Digikey: PCC2277TR-ND] 0.22 µF 16V 10% X7R [Digikey: 445-1318-1-ND] 1.0 µF 25V 10% [Digikey: 445-5146-2-ND] 0603 - RF Specific 3pF 250V +/-0.1pF RF [Digikey: 712-1347-1-ND] 18 pF 250V 5% [Digikey: 478-3505-1-ND or 712-1322-1-ND] 56 pF 250V 5% C0G RF [Digikey: 490-4867-1-ND] 68 pF 250V RF [Digikey: 490-4868-1-ND] 0805 - 0805 Surface Mount Capacitors 220 pF 250V 2% RF Ceramic Capacitor [Digikey: 712-1398-1-ND] 1000 pF 50V 2% NP0 Ceramic Capacitor [Digikey: 478-3760-1-ND] 0.1 µF 25V 10% Ceramic Capacitor [Digikey: PCC1828TR-ND] 1.0 µF 16V 10% Ceramic Capacitor[Digikey: 490-1691-2-ND] 10.0 µF 10V 10% Ceramic Capacitor[Digikey: 709-1228-1-ND] 10.0 uF 16V 10% Ceramic Capacitor [Digikey: 478-5165-2-ND] 47 uF 6.3V 20% Ceramic Capacitor [Digikey: 587-1779-1-ND or 399-5506-1-ND] 1206 - 1206 Surface Mount Capacitors 47uF 10V 20% Ceramic Capacitor [Digikey: 490-5528-1-ND or 399-5508-1-ND or 445-6010-1-ND] 100uF 6.3V -20%, +80% Y5V Ceramic Capacitor (Digikey: 490-4512-1-ND, Mouser: 81-GRM31CF50J107ZE1L); PARTNO: GRM1885C1H472JA01D
C3 C7 C11 C15 C19 C23 C27 C31 C35 C39 C43 C47 = rcl:CPOL-US: POLARIZED CAPACITOR, American symbol; PARTNO: ESK107M025AC3AA; SPICEPREFIX: C
C4 C8 C12 C16 C20 C24 C28 C32 C36 C40 C44 C48 C54 C57-C71 C76 C95 C99 C102 C103 = keves-ng:CAP_CERAMIC: Ceramic Capacitors 0402 - 0402 Surface Mount Capacitors 16pF 50V 5% [Digikey: 445-4899-2-ND] 18pF 50V 5% [Digikey: 490-1281-2-ND] 22pF 50V 5% [Digikey: 490-1283-2-ND] 68pF 50V 5% [Digikey: 490-1289-2-ND] 0.1uF 10V 10% [Digikey: 490-1318-2-ND] 1.0uF 6.3V 10% [Digikey: 490-1320-2-ND] 0603 - 0603 Surface Mount Capacitors 16 pF 50V 5% [Digikey: 445-5051-2-ND] 22 pF 50V [Digikey: PCC220ACVTR-ND] 33 pF 50V 5% [Digikey: 490-1415-1-ND] 56pF 50V 5% [Digikey: 490-1421-1-ND] 220pF 50V 5% [Digikey: 445-1285-1-ND] 680 pF 50V 2200 pF 50V 5% C0G [Digikey: 445-1297-1-ND] 5600 pF 100V 5% X7R [Digikey: 478-3711-1-ND] 0.1 µF 25V 10% [Digikey: PCC2277TR-ND] 0.22 µF 16V 10% X7R [Digikey: 445-1318-1-ND] 1.0 µF 25V 10% [Digikey: 445-5146-2-ND] 0603 - RF Specific 3pF 250V +/-0.1pF RF [Digikey: 712-1347-1-ND] 18 pF 250V 5% [Digikey: 478-3505-1-ND or 712-1322-1-ND] 56 pF 250V 5% C0G RF [Digikey: 490-4867-1-ND] 68 pF 250V RF [Digikey: 490-4868-1-ND] 0805 - 0805 Surface Mount Capacitors 220 pF 250V 2% RF Ceramic Capacitor [Digikey: 712-1398-1-ND] 1000 pF 50V 2% NP0 Ceramic Capacitor [Digikey: 478-3760-1-ND] 0.1 µF 25V 10% Ceramic Capacitor [Digikey: PCC1828TR-ND] 1.0 µF 16V 10% Ceramic Capacitor[Digikey: 490-1691-2-ND] 10.0 µF 10V 10% Ceramic Capacitor[Digikey: 709-1228-1-ND] 10.0 uF 16V 10% Ceramic Capacitor [Digikey: 478-5165-2-ND] 47 uF 6.3V 20% Ceramic Capacitor [Digikey: 587-1779-1-ND or 399-5506-1-ND] 1206 - 1206 Surface Mount Capacitors 47uF 10V 20% Ceramic Capacitor [Digikey: 490-5528-1-ND or 399-5508-1-ND or 445-6010-1-ND] 100uF 6.3V -20%, +80% Y5V Ceramic Capacitor (Digikey: 490-4512-1-ND, Mouser: 81-GRM31CF50J107ZE1L); PARTNO: CC0603KRX7R9BB104
C49-C53 C96 C100 = keves-ng:CAP_CERAMIC: Ceramic Capacitors 0402 - 0402 Surface Mount Capacitors 16pF 50V 5% [Digikey: 445-4899-2-ND] 18pF 50V 5% [Digikey: 490-1281-2-ND] 22pF 50V 5% [Digikey: 490-1283-2-ND] 68pF 50V 5% [Digikey: 490-1289-2-ND] 0.1uF 10V 10% [Digikey: 490-1318-2-ND] 1.0uF 6.3V 10% [Digikey: 490-1320-2-ND] 0603 - 0603 Surface Mount Capacitors 16 pF 50V 5% [Digikey: 445-5051-2-ND] 22 pF 50V [Digikey: PCC220ACVTR-ND] 33 pF 50V 5% [Digikey: 490-1415-1-ND] 56pF 50V 5% [Digikey: 490-1421-1-ND] 220pF 50V 5% [Digikey: 445-1285-1-ND] 680 pF 50V 2200 pF 50V 5% C0G [Digikey: 445-1297-1-ND] 5600 pF 100V 5% X7R [Digikey: 478-3711-1-ND] 0.1 µF 25V 10% [Digikey: PCC2277TR-ND] 0.22 µF 16V 10% X7R [Digikey: 445-1318-1-ND] 1.0 µF 25V 10% [Digikey: 445-5146-2-ND] 0603 - RF Specific 3pF 250V +/-0.1pF RF [Digikey: 712-1347-1-ND] 18 pF 250V 5% [Digikey: 478-3505-1-ND or 712-1322-1-ND] 56 pF 250V 5% C0G RF [Digikey: 490-4867-1-ND] 68 pF 250V RF [Digikey: 490-4868-1-ND] 0805 - 0805 Surface Mount Capacitors 220 pF 250V 2% RF Ceramic Capacitor [Digikey: 712-1398-1-ND] 1000 pF 50V 2% NP0 Ceramic Capacitor [Digikey: 478-3760-1-ND] 0.1 µF 25V 10% Ceramic Capacitor [Digikey: PCC1828TR-ND] 1.0 µF 16V 10% Ceramic Capacitor[Digikey: 490-1691-2-ND] 10.0 µF 10V 10% Ceramic Capacitor[Digikey: 709-1228-1-ND] 10.0 uF 16V 10% Ceramic Capacitor [Digikey: 478-5165-2-ND] 47 uF 6.3V 20% Ceramic Capacitor [Digikey: 587-1779-1-ND or 399-5506-1-ND] 1206 - 1206 Surface Mount Capacitors 47uF 10V 20% Ceramic Capacitor [Digikey: 490-5528-1-ND or 399-5508-1-ND or 445-6010-1-ND] 100uF 6.3V -20%, +80% Y5V Ceramic Capacitor (Digikey: 490-4512-1-ND, Mouser: 81-GRM31CF50J107ZE1L); PARTNO: CL21A106KAYNNNE
C55 C56 C72 = keves-ng:CAP_CERAMIC: Ceramic Capacitors 0402 - 0402 Surface Mount Capacitors 16pF 50V 5% [Digikey: 445-4899-2-ND] 18pF 50V 5% [Digikey: 490-1281-2-ND] 22pF 50V 5% [Digikey: 490-1283-2-ND] 68pF 50V 5% [Digikey: 490-1289-2-ND] 0.1uF 10V 10% [Digikey: 490-1318-2-ND] 1.0uF 6.3V 10% [Digikey: 490-1320-2-ND] 0603 - 0603 Surface Mount Capacitors 16 pF 50V 5% [Digikey: 445-5051-2-ND] 22 pF 50V [Digikey: PCC220ACVTR-ND] 33 pF 50V 5% [Digikey: 490-1415-1-ND] 56pF 50V 5% [Digikey: 490-1421-1-ND] 220pF 50V 5% [Digikey: 445-1285-1-ND] 680 pF 50V 2200 pF 50V 5% C0G [Digikey: 445-1297-1-ND] 5600 pF 100V 5% X7R [Digikey: 478-3711-1-ND] 0.1 µF 25V 10% [Digikey: PCC2277TR-ND] 0.22 µF 16V 10% X7R [Digikey: 445-1318-1-ND] 1.0 µF 25V 10% [Digikey: 445-5146-2-ND] 0603 - RF Specific 3pF 250V +/-0.1pF RF [Digikey: 712-1347-1-ND] 18 pF 250V 5% [Digikey: 478-3505-1-ND or 712-1322-1-ND] 56 pF 250V 5% C0G RF [Digikey: 490-4867-1-ND] 68 pF 250V RF [Digikey: 490-4868-1-ND] 0805 - 0805 Surface Mount Capacitors 220 pF 250V 2% RF Ceramic Capacitor [Digikey: 712-1398-1-ND] 1000 pF 50V 2% NP0 Ceramic Capacitor [Digikey: 478-3760-1-ND] 0.1 µF 25V 10% Ceramic Capacitor [Digikey: PCC1828TR-ND] 1.0 µF 16V 10% Ceramic Capacitor[Digikey: 490-1691-2-ND] 10.0 µF 10V 10% Ceramic Capacitor[Digikey: 709-1228-1-ND] 10.0 uF 16V 10% Ceramic Capacitor [Digikey: 478-5165-2-ND] 47 uF 6.3V 20% Ceramic Capacitor [Digikey: 587-1779-1-ND or 399-5506-1-ND] 1206 - 1206 Surface Mount Capacitors 47uF 10V 20% Ceramic Capacitor [Digikey: 490-5528-1-ND or 399-5508-1-ND or 445-6010-1-ND] 100uF 6.3V -20%, +80% Y5V Ceramic Capacitor (Digikey: 490-4512-1-ND, Mouser: 81-GRM31CF50J107ZE1L); PARTNO: CL31B225KBHNNNE
C73 C74 = keves-ng:CAP_CERAMIC: Ceramic Capacitors 0402 - 0402 Surface Mount Capacitors 16pF 50V 5% [Digikey: 445-4899-2-ND] 18pF 50V 5% [Digikey: 490-1281-2-ND] 22pF 50V 5% [Digikey: 490-1283-2-ND] 68pF 50V 5% [Digikey: 490-1289-2-ND] 0.1uF 10V 10% [Digikey: 490-1318-2-ND] 1.0uF 6.3V 10% [Digikey: 490-1320-2-ND] 0603 - 0603 Surface Mount Capacitors 16 pF 50V 5% [Digikey: 445-5051-2-ND] 22 pF 50V [Digikey: PCC220ACVTR-ND] 33 pF 50V 5% [Digikey: 490-1415-1-ND] 56pF 50V 5% [Digikey: 490-1421-1-ND] 220pF 50V 5% [Digikey: 445-1285-1-ND] 680 pF 50V 2200 pF 50V 5% C0G [Digikey: 445-1297-1-ND] 5600 pF 100V 5% X7R [Digikey: 478-3711-1-ND] 0.1 µF 25V 10% [Digikey: PCC2277TR-ND] 0.22 µF 16V 10% X7R [Digikey: 445-1318-1-ND] 1.0 µF 25V 10% [Digikey: 445-5146-2-ND] 0603 - RF Specific 3pF 250V +/-0.1pF RF [Digikey: 712-1347-1-ND] 18 pF 250V 5% [Digikey: 478-3505-1-ND or 712-1322-1-ND] 56 pF 250V 5% C0G RF [Digikey: 490-4867-1-ND] 68 pF 250V RF [Digikey: 490-4868-1-ND] 0805 - 0805 Surface Mount Capacitors 220 pF 250V 2% RF Ceramic Capacitor [Digikey: 712-1398-1-ND] 1000 pF 50V 2% NP0 Ceramic Capacitor [Digikey: 478-3760-1-ND] 0.1 µF 25V 10% Ceramic Capacitor [Digikey: PCC1828TR-ND] 1.0 µF 16V 10% Ceramic Capacitor[Digikey: 490-1691-2-ND] 10.0 µF 10V 10% Ceramic Capacitor[Digikey: 709-1228-1-ND] 10.0 uF 16V 10% Ceramic Capacitor [Digikey: 478-5165-2-ND] 47 uF 6.3V 20% Ceramic Capacitor [Digikey: 587-1779-1-ND or 399-5506-1-ND] 1206 - 1206 Surface Mount Capacitors 47uF 10V 20% Ceramic Capacitor [Digikey: 490-5528-1-ND or 399-5508-1-ND or 445-6010-1-ND] 100uF 6.3V -20%, +80% Y5V Ceramic Capacitor (Digikey: 490-4512-1-ND, Mouser: 81-GRM31CF50J107ZE1L); PARTNO: 06035A180JAT2A
C75 = keves-ng:CAP_CERAMIC: Ceramic Capacitors 0402 - 0402 Surface Mount Capacitors 16pF 50V 5% [Digikey: 445-4899-2-ND] 18pF 50V 5% [Digikey: 490-1281-2-ND] 22pF 50V 5% [Digikey: 490-1283-2-ND] 68pF 50V 5% [Digikey: 490-1289-2-ND] 0.1uF 10V 10% [Digikey: 490-1318-2-ND] 1.0uF 6.3V 10% [Digikey: 490-1320-2-ND] 0603 - 0603 Surface Mount Capacitors 16 pF 50V 5% [Digikey: 445-5051-2-ND] 22 pF 50V [Digikey: PCC220ACVTR-ND] 33 pF 50V 5% [Digikey: 490-1415-1-ND] 56pF 50V 5% [Digikey: 490-1421-1-ND] 220pF 50V 5% [Digikey: 445-1285-1-ND] 680 pF 50V 2200 pF 50V 5% C0G [Digikey: 445-1297-1-ND] 5600 pF 100V 5% X7R [Digikey: 478-3711-1-ND] 0.1 µF 25V 10% [Digikey: PCC2277TR-ND] 0.22 µF 16V 10% X7R [Digikey: 445-1318-1-ND] 1.0 µF 25V 10% [Digikey: 445-5146-2-ND] 0603 - RF Specific 3pF 250V +/-0.1pF RF [Digikey: 712-1347-1-ND] 18 pF 250V 5% [Digikey: 478-3505-1-ND or 712-1322-1-ND] 56 pF 250V 5% C0G RF [Digikey: 490-4867-1-ND] 68 pF 250V RF [Digikey: 490-4868-1-ND] 0805 - 0805 Surface Mount Capacitors 220 pF 250V 2% RF Ceramic Capacitor [Digikey: 712-1398-1-ND] 1000 pF 50V 2% NP0 Ceramic Capacitor [Digikey: 478-3760-1-ND] 0.1 µF 25V 10% Ceramic Capacitor [Digikey: PCC1828TR-ND] 1.0 µF 16V 10% Ceramic Capacitor[Digikey: 490-1691-2-ND] 10.0 µF 10V 10% Ceramic Capacitor[Digikey: 709-1228-1-ND] 10.0 uF 16V 10% Ceramic Capacitor [Digikey: 478-5165-2-ND] 47 uF 6.3V 20% Ceramic Capacitor [Digikey: 587-1779-1-ND or 399-5506-1-ND] 1206 - 1206 Surface Mount Capacitors 47uF 10V 20% Ceramic Capacitor [Digikey: 490-5528-1-ND or 399-5508-1-ND or 445-6010-1-ND] 100uF 6.3V -20%, +80% Y5V Ceramic Capacitor (Digikey: 490-4512-1-ND, Mouser: 81-GRM31CF50J107ZE1L); PARTNO: GRM188Z71A475ME15D
C77 = keves-ng:CAP_ELECTROLYTIC: Electrolytic Capacitors SMT PANASONIC_C - Size C Panasonic Electrolytic Aluminum Capacitor 47µF 16V 20% Electrolytic Capacitor [Digikey: PCE3890TR-ND] PANASONIC_D - Size D Panasonic Electrolytic Aluminum Capacitor 100µF 25V 20% Electrolytic Capacitor [Digikey: PCE3898TR-ND] PTH 3.5 mm grid, 8 mm diameter ... 3.5 mm grid, 10 mm diameter ...; PARTNO: EEE-HAV101XAP
C80 C84-C86 C90 C91 = keves-ng:CAP_CERAMIC: Ceramic Capacitors 0402 - 0402 Surface Mount Capacitors 16pF 50V 5% [Digikey: 445-4899-2-ND] 18pF 50V 5% [Digikey: 490-1281-2-ND] 22pF 50V 5% [Digikey: 490-1283-2-ND] 68pF 50V 5% [Digikey: 490-1289-2-ND] 0.1uF 10V 10% [Digikey: 490-1318-2-ND] 1.0uF 6.3V 10% [Digikey: 490-1320-2-ND] 0603 - 0603 Surface Mount Capacitors 16 pF 50V 5% [Digikey: 445-5051-2-ND] 22 pF 50V [Digikey: PCC220ACVTR-ND] 33 pF 50V 5% [Digikey: 490-1415-1-ND] 56pF 50V 5% [Digikey: 490-1421-1-ND] 220pF 50V 5% [Digikey: 445-1285-1-ND] 680 pF 50V 2200 pF 50V 5% C0G [Digikey: 445-1297-1-ND] 5600 pF 100V 5% X7R [Digikey: 478-3711-1-ND] 0.1 µF 25V 10% [Digikey: PCC2277TR-ND] 0.22 µF 16V 10% X7R [Digikey: 445-1318-1-ND] 1.0 µF 25V 10% [Digikey: 445-5146-2-ND] 0603 - RF Specific 3pF 250V +/-0.1pF RF [Digikey: 712-1347-1-ND] 18 pF 250V 5% [Digikey: 478-3505-1-ND or 712-1322-1-ND] 56 pF 250V 5% C0G RF [Digikey: 490-4867-1-ND] 68 pF 250V RF [Digikey: 490-4868-1-ND] 0805 - 0805 Surface Mount Capacitors 220 pF 250V 2% RF Ceramic Capacitor [Digikey: 712-1398-1-ND] 1000 pF 50V 2% NP0 Ceramic Capacitor [Digikey: 478-3760-1-ND] 0.1 µF 25V 10% Ceramic Capacitor [Digikey: PCC1828TR-ND] 1.0 µF 16V 10% Ceramic Capacitor[Digikey: 490-1691-2-ND] 10.0 µF 10V 10% Ceramic Capacitor[Digikey: 709-1228-1-ND] 10.0 uF 16V 10% Ceramic Capacitor [Digikey: 478-5165-2-ND] 47 uF 6.3V 20% Ceramic Capacitor [Digikey: 587-1779-1-ND or 399-5506-1-ND] 1206 - 1206 Surface Mount Capacitors 47uF 10V 20% Ceramic Capacitor [Digikey: 490-5528-1-ND or 399-5508-1-ND or 445-6010-1-ND] 100uF 6.3V -20%, +80% Y5V Ceramic Capacitor (Digikey: 490-4512-1-ND, Mouser: 81-GRM31CF50J107ZE1L); PARTNO: GMK107AB7105KAHT
C81-C83 C87-C89 C92 C93 = keves-ng:CAP_ELECTROLYTIC: Electrolytic Capacitors SMT PANASONIC_C - Size C Panasonic Electrolytic Aluminum Capacitor 47µF 16V 20% Electrolytic Capacitor [Digikey: PCE3890TR-ND] PANASONIC_D - Size D Panasonic Electrolytic Aluminum Capacitor 100µF 25V 20% Electrolytic Capacitor [Digikey: PCE3898TR-ND] PTH 3.5 mm grid, 8 mm diameter ... 3.5 mm grid, 10 mm diameter ...; PARTNO: EEE-HA1V100R
C94 C98 = keves-ng:CAP_CERAMIC: Ceramic Capacitors 0402 - 0402 Surface Mount Capacitors 16pF 50V 5% [Digikey: 445-4899-2-ND] 18pF 50V 5% [Digikey: 490-1281-2-ND] 22pF 50V 5% [Digikey: 490-1283-2-ND] 68pF 50V 5% [Digikey: 490-1289-2-ND] 0.1uF 10V 10% [Digikey: 490-1318-2-ND] 1.0uF 6.3V 10% [Digikey: 490-1320-2-ND] 0603 - 0603 Surface Mount Capacitors 16 pF 50V 5% [Digikey: 445-5051-2-ND] 22 pF 50V [Digikey: PCC220ACVTR-ND] 33 pF 50V 5% [Digikey: 490-1415-1-ND] 56pF 50V 5% [Digikey: 490-1421-1-ND] 220pF 50V 5% [Digikey: 445-1285-1-ND] 680 pF 50V 2200 pF 50V 5% C0G [Digikey: 445-1297-1-ND] 5600 pF 100V 5% X7R [Digikey: 478-3711-1-ND] 0.1 µF 25V 10% [Digikey: PCC2277TR-ND] 0.22 µF 16V 10% X7R [Digikey: 445-1318-1-ND] 1.0 µF 25V 10% [Digikey: 445-5146-2-ND] 0603 - RF Specific 3pF 250V +/-0.1pF RF [Digikey: 712-1347-1-ND] 18 pF 250V 5% [Digikey: 478-3505-1-ND or 712-1322-1-ND] 56 pF 250V 5% C0G RF [Digikey: 490-4867-1-ND] 68 pF 250V RF [Digikey: 490-4868-1-ND] 0805 - 0805 Surface Mount Capacitors 220 pF 250V 2% RF Ceramic Capacitor [Digikey: 712-1398-1-ND] 1000 pF 50V 2% NP0 Ceramic Capacitor [Digikey: 478-3760-1-ND] 0.1 µF 25V 10% Ceramic Capacitor [Digikey: PCC1828TR-ND] 1.0 µF 16V 10% Ceramic Capacitor[Digikey: 490-1691-2-ND] 10.0 µF 10V 10% Ceramic Capacitor[Digikey: 709-1228-1-ND] 10.0 uF 16V 10% Ceramic Capacitor [Digikey: 478-5165-2-ND] 47 uF 6.3V 20% Ceramic Capacitor [Digikey: 587-1779-1-ND or 399-5506-1-ND] 1206 - 1206 Surface Mount Capacitors 47uF 10V 20% Ceramic Capacitor [Digikey: 490-5528-1-ND or 399-5508-1-ND or 445-6010-1-ND] 100uF 6.3V -20%, +80% Y5V Ceramic Capacitor (Digikey: 490-4512-1-ND, Mouser: 81-GRM31CF50J107ZE1L); PARTNO: UMK212BB7225KG-T
C97 C101 = keves-ng:CAP_CERAMIC: Ceramic Capacitors 0402 - 0402 Surface Mount Capacitors 16pF 50V 5% [Digikey: 445-4899-2-ND] 18pF 50V 5% [Digikey: 490-1281-2-ND] 22pF 50V 5% [Digikey: 490-1283-2-ND] 68pF 50V 5% [Digikey: 490-1289-2-ND] 0.1uF 10V 10% [Digikey: 490-1318-2-ND] 1.0uF 6.3V 10% [Digikey: 490-1320-2-ND] 0603 - 0603 Surface Mount Capacitors 16 pF 50V 5% [Digikey: 445-5051-2-ND] 22 pF 50V [Digikey: PCC220ACVTR-ND] 33 pF 50V 5% [Digikey: 490-1415-1-ND] 56pF 50V 5% [Digikey: 490-1421-1-ND] 220pF 50V 5% [Digikey: 445-1285-1-ND] 680 pF 50V 2200 pF 50V 5% C0G [Digikey: 445-1297-1-ND] 5600 pF 100V 5% X7R [Digikey: 478-3711-1-ND] 0.1 µF 25V 10% [Digikey: PCC2277TR-ND] 0.22 µF 16V 10% X7R [Digikey: 445-1318-1-ND] 1.0 µF 25V 10% [Digikey: 445-5146-2-ND] 0603 - RF Specific 3pF 250V +/-0.1pF RF [Digikey: 712-1347-1-ND] 18 pF 250V 5% [Digikey: 478-3505-1-ND or 712-1322-1-ND] 56 pF 250V 5% C0G RF [Digikey: 490-4867-1-ND] 68 pF 250V RF [Digikey: 490-4868-1-ND] 0805 - 0805 Surface Mount Capacitors 220 pF 250V 2% RF Ceramic Capacitor [Digikey: 712-1398-1-ND] 1000 pF 50V 2% NP0 Ceramic Capacitor [Digikey: 478-3760-1-ND] 0.1 µF 25V 10% Ceramic Capacitor [Digikey: PCC1828TR-ND] 1.0 µF 16V 10% Ceramic Capacitor[Digikey: 490-1691-2-ND] 10.0 µF 10V 10% Ceramic Capacitor[Digikey: 709-1228-1-ND] 10.0 uF 16V 10% Ceramic Capacitor [Digikey: 478-5165-2-ND] 47 uF 6.3V 20% Ceramic Capacitor [Digikey: 587-1779-1-ND or 399-5506-1-ND] 1206 - 1206 Surface Mount Capacitors 47uF 10V 20% Ceramic Capacitor [Digikey: 490-5528-1-ND or 399-5508-1-ND or 445-6010-1-ND] 100uF 6.3V -20%, +80% Y5V Ceramic Capacitor (Digikey: 490-4512-1-ND, Mouser: 81-GRM31CF50J107ZE1L); PARTNO: 12065C105M4Z2A
D1-D4 = keves-ng:DIODE: Diode SMA Model Volts Amps Type Vf Vr Digikey # Notes SSA34-E3 40V 3A Schottky 480mV @ 3A 200uA @ 40V SSA34-E3/61TGITR-ND CDBA120-G 20V 1A Schottky 500mV @ 1A 500uA @ 20V 641-1014-6-ND REEL MBRA210 10V 2A Schottky 350mV @ 2A 700uA @ 10V MBRA210LT3 SOD-123 Model Volts Amps Type Vf Vr Order # Notes BAT54T1G 30V 200mA Schottky 800mV @ 200mA 2uA @ 25V BAT54T1GOSTR-ND B0530W 30V 500mA Schottky 430mV @ 500mA 130uA @ 30V B0530W-FDICT-ND REEL MBR120 1A 20V Schottky 340mV @ 1A MBR120VLSFT1GOSCT-ND SOD-323 Model Volts Amps Type Vf Vr Order # Notes PMEG2005EJ 20V 500mA Schottky 355mV @ 500mA 568-4110-1-ND ZLLS410 10V 570mA Schottky 380mV @ 570mA ZLLS410CT-ND 1N4148WS 75V 150mA Silicon/Simple 1V 1N4148WSFSCT-ND REEL SOD-523 Model Volts Amps Type Vf Vr Order # Notes BAT54XV2 30V 200mA Schottky 0.8V @ 100mA BAT54XV2CT-ND TB751S 30V 30mA Schottky RB751S-40TE61CT-ND SOT23-R/W (R = Solder Paste/Reflow Ovens, W = Hand-Soldering) Model Volts Amps Type Vf Vr Order # Notes BAT54FILM 40V 300mA Schottky 497-7162-1-ND; PARTNO: MBR120LSFT3G
H1-H7 = holes:MOUNT-HOLE: MOUNTING HOLE with drill center marker; PARTNO: *
IC1-IC6 = keves-ng:TL072: OP AMP; PARTNO: TL072SG-13
IC7 = keves-ng:AT45DB161D: 16-megabit 2.5V or 2.7V DataFlash Source: http://www.atmel.com/dyn/resources/prod_documents/doc3500.pdf; MF: ATMEL; MPN: AT45DB161D-SU; OC_FARNELL: 1455040; PARTNO: AT45DB161D-SU
IC10 = keves-ng:LM317; PARTNO: LM317MBSTT3G
IC11 = keves-ng:LM337; PARTNO: LM337IMPX/NOPB
JP6 = keves-ng:JP4QE: JUMPER; PARTNO: M20-9760446
L1 L3-L6 = keves-ng:INDUCTOR: Inductors 0603: 10nH Ceramic Inductor - microwire antenna/RF (Digikey: 712-1434-2-ND) 0805: 560nH Ceramic Inductor - RF (Digikey: 553-1047-1-ND) 270nH Ceramic Inductor - Q = 40@250MHz, +-5%, 1 Ohm DC Resistance (Digikey: 535-10506-2-ND) 1007 (2518 Metric) SMT: 10µH 10% 250mOhm 820mA 1007 Inductor (Digikey: 587-2189-1-ND) 22µH 10% 500mOhm 580mA 1007 Inductor (Digikey: 587-2190-1-ND) 47µH 10% 950mOhm 420mA 1007 Inductor (Digikey: 587-2191-1-ND) 47µH 5% 100mOhm 1A 1008 Inductor (Digikey: 732-1816-1-ND) 5.0x5.0mm (Taiyo Yuden NR5040 Series) 6.8µH 20% 2.3A 64mOhm Inductor (Digikey: 587-2374-2-ND) 5.0x5.0mm (TDK VLC5045 Series) 4.7µH 20% 3.3A 34mOhm Inductor (Digikey: 445-6526-1-ND) 6.8µH 20% 2.7A 46mOhm Inductor (Digikey: 445-6527-1-ND) 6.0x6.0mm (TDK VLC6045 Series) 4.7µH 20% 3.8A 27mOhm Inductor (Digikey: 445-6538-2-ND) 6.8µH 20% 3A 41mOhm Inductor (Digikey: 445-6540-1-ND) 6.2µH 30% 2.2A 45mOhm Inductor (Digikey: SRR5028-6R2YCT-ND) - Not TDK VLC6045 but footprint should match 6.0x6.0mm (TDK SLF6045 Series) 6.8uH 30% 2A 33mOhm Inductor (Digikey: 445-4572-1-ND, Mouser: 810-SLF645T6R8N2R0PF); PARTNO: BLM18KG601SN1D
L7 = rcl:L-US: INDUCTOR, American symbol; PARTNO: PM1812-5R6J-RC; SPICEPREFIX: L
LED1 = keves-ng:WP934SA_LILYLGD: LED Circuit Board Indicators 3mm 617/588/568nm LED INDICATOR Source: Datasheet <http://www.kingbrightusa.com/images/catalog/SPEC/WP934SA-LILYLGD.pdf>; PARTNO: WP934SA/LILYLGD
LED2 = keves-ng:LED: LED 0603 - 0603 Surface Mount Package 2mA: Green LED - Low Power (3.9mcd, 2ma, 1.7Vf) - Digikey: 475-2709-2-ND Orange LED - Low Power (9.8mcd, 2ma, 1.8Vf) - Digikey: 475-1194-2-ND Red LED - Low Power (5mcd, 2ma, 1.8Vf) - Digikey: 475-1195-2-ND Yellow LED - Low Power (7mcd, 2ma, 1.8Vf) - Digikey: 475-1196-2-ND 5mA: Blue LED - Low Power (17mcd, 5ma, 2.9Vf) - Digikey: LNJ937W8CRACT-ND 0805 - 0805 Surface Mount Package 2mA: Red LED (8.8mcd, 2mA, 1.8Vf, Clear) - Low Power [Digikey: 475-2510-1-ND] Green LED (5mcd, 2mA, 1.8Vf, Clear) - Low Power [Digikey: 475-2730-1-ND] Yellow LED (11.3mcd, 2mA, 1.8Vf, Clear) - Low Power [Digikey: 475-2555-1-ND] 20mA: Red LED (104mcd, 20mA, Diffused) - LS R976 [Digikey: 475-1278-6-ND] Red LED (12mcd, 20mA, 2.0Vf, Clear) - APT2012EC [Digikey: 754-1128-1-ND] Green LED (15mcd, 20mA, 2.2Vf, Clear) - APT2012GC [Digikey: 754-1131-1-ND] Orange LED (160mcd, 20mA, 2.1Vf, Clear) - APT2012SECK [Digikey: 754-1130-1-ND] 1206 - 1206 Surface Mount Package Green LED (26mcd, 20mA, Diffused) - LG N971 [Digikey: 475-1407-6-ND] Red LED (15mcd, 20mA, Diffused) - LH N974 [Digikey: 475-1416-6-ND]; PARTNO: AP2012HD
OSC1 = keves-ng:OSCILLATOR: Oscillators 3.2x2.5mm SMT 4.0MHz +/- 50ppm, 3.3V, 9mA, -40/+85°C - Digikey: 535-9752-1-ND 50MHz +/- 50ppm, 3.3V, 8mA, -10/+70°C - Digikey: 478-4792-1-ND 5x7mm SMT 4.0MHz +/-20ppm 3.3V, 20mA, -20/+70°C - Digikey: 535-9329-2-ND 50MHz +/- 25ppm 3.3V, 35mA, -40/+85°C - Digikey: 631-1197-1-ND; PARTNO: C3391-12.288
PL1-PL6 = keves-ng:NSJ12HF-1: Phone Connectors 1/4" STACKING STEREO Source: Datasheet <http://www.neutrik.us/zoolu-website/media/download/13538/Product Guide - Section Plugs & Jacks.pdf>; DESCRIPTION: Phone Connectors 1/4" STACKING STEREO; HEIGHT: 31.75mm; MANUFACTURER_NAME: Neutrik; MANUFACTURER_PART_NUMBER: NSJ12HF-1; MOUSER_PART_NUMBER: 568-NSJ12HF-1; MOUSER_PRICE-STOCK: https://www.mouser.co.uk/ProductDetail/Neutrik/NSJ12HF-1?qs=43pPWqpsSNuxu1dXwKXeEA%3D%3D; PARTNO: NSJ12HC
R1 R8 R9 R16 R17 R24 R25 R32 R33 R40 R41 R48 = keves-ng:RESISTOR: Resistors 0402 - 0402 Surface Mount Package 22 Ohm 1% 1/16W [Digikey: 311-22.0LRTR-ND] 33 Ohm 5% 1/16W 1.0K 5% 1/16W 1.5K 5% 1/16W 2.0K 1% 1/16W 10.0K 1% 1/16W [Digikey: 311-10.0KLRTR-ND] 10.0K 5% 1/16W [Digikey: RMCF0402JT10K0TR-ND] 12.1K 1% 1/16W [Digikey: 311-22.0LRTR-ND] 100.0K 5% 1/16W 0603 - 0603 Surface Mount Package 0 Ohm 1/10 Watt 1% Resistor 15 Ohm 1/10 Watt 1% Resistor 33 Ohm 1/10 Watt 1% Resistor 49.9 Ohm 1/10 Watt 1% Resistor 100 Ohm 1/10 Watt 1% Resistor 150 Ohm 1/10 Watt 1% Resistor 240 Ohm 1/10 Watt 1% Resistor 390 Ohm 1/10 Watt 1% Resistor 560 Ohm 1/10 Watt 1% Resistor 680 Ohm 1/10 Watt 1% Resistor 750 Ohm 1/10 Watt 1% Resistor 1.0K Ohm 1/10 Watt 1% Resistor 1.5K Ohm 1/10 Watt 1% Resistor 2.0K Ohm 1/10 Watt 1% Resistor 2.2K Ohm 1/10 Watt 1% Resistor 3.3K Ohm 1/10 Watt 1% Resistor 4.7K Ohm 1/10 Watt 1% Resistor 10.0K Ohm 1/10 Watt 1% Resistor 12.0K Ohm 1/10 Watt 1% Resistor 12.1K Ohm 1/10 Watt 1% Resistor 20.0K Ohm 1/10 Watt 1% Resistor 33.0K Ohm 1/10 Watt 1% Resistor 100.0K Ohm 1/10 Watt 1% Resistor 0805 - 0805 Surface Mount Package 0 Ohm 1/8 Watt 1% Resistor 33 Ohm 1/8 Watt 1% Resistor 100 Ohm 1/8 Watt 1% Resistor 150 Ohm 1/8 Watt 1% Resistor 200 Ohm 1/8 Watt 1% Resistor 240 Ohm 1/8 Watt 1% Resistor 330 Ohm 1/8 Watt 1% Resistor 390 Ohm 1/8 Watt 1% Resistor 470 Ohm 1/8 Watt 1% Resistor 1.0K Ohm 1/8 Watt 1% Resistor 1.5K Ohm 1/8 Watt 1% Resistor 2.0K Ohm 1/8 Watt 1% Resistor 4.7K Ohm 1/8 Watt 1% Resistor 5.1K Ohm 1/8 Watt 1% Resistor 5.6K Ohm 1/8 Watt 1% Resistor 10.0K Ohm 1/8 Watt 1% Resistor 22.0K Ohm 1/8 Watt 1% Resistor 33.0K Ohm 1/8 Watt 1% Resistor 100K Ohm 1/8 Watt 1% Resistor 1206 - 1206 Surface Mount Package 2012 - 2010 Surface Mount Package 0.11 Ohm 1/2 Watt 1% Resistor - Digikey: RHM.11UCT-ND; PARTNO: CRCW060347R0FKEAC
R2 R5 R10 R13 R18 R21 R26 R29 R34 R37 R42 R45 = keves-ng:RESISTOR: Resistors 0402 - 0402 Surface Mount Package 22 Ohm 1% 1/16W [Digikey: 311-22.0LRTR-ND] 33 Ohm 5% 1/16W 1.0K 5% 1/16W 1.5K 5% 1/16W 2.0K 1% 1/16W 10.0K 1% 1/16W [Digikey: 311-10.0KLRTR-ND] 10.0K 5% 1/16W [Digikey: RMCF0402JT10K0TR-ND] 12.1K 1% 1/16W [Digikey: 311-22.0LRTR-ND] 100.0K 5% 1/16W 0603 - 0603 Surface Mount Package 0 Ohm 1/10 Watt 1% Resistor 15 Ohm 1/10 Watt 1% Resistor 33 Ohm 1/10 Watt 1% Resistor 49.9 Ohm 1/10 Watt 1% Resistor 100 Ohm 1/10 Watt 1% Resistor 150 Ohm 1/10 Watt 1% Resistor 240 Ohm 1/10 Watt 1% Resistor 390 Ohm 1/10 Watt 1% Resistor 560 Ohm 1/10 Watt 1% Resistor 680 Ohm 1/10 Watt 1% Resistor 750 Ohm 1/10 Watt 1% Resistor 1.0K Ohm 1/10 Watt 1% Resistor 1.5K Ohm 1/10 Watt 1% Resistor 2.0K Ohm 1/10 Watt 1% Resistor 2.2K Ohm 1/10 Watt 1% Resistor 3.3K Ohm 1/10 Watt 1% Resistor 4.7K Ohm 1/10 Watt 1% Resistor 10.0K Ohm 1/10 Watt 1% Resistor 12.0K Ohm 1/10 Watt 1% Resistor 12.1K Ohm 1/10 Watt 1% Resistor 20.0K Ohm 1/10 Watt 1% Resistor 33.0K Ohm 1/10 Watt 1% Resistor 100.0K Ohm 1/10 Watt 1% Resistor 0805 - 0805 Surface Mount Package 0 Ohm 1/8 Watt 1% Resistor 33 Ohm 1/8 Watt 1% Resistor 100 Ohm 1/8 Watt 1% Resistor 150 Ohm 1/8 Watt 1% Resistor 200 Ohm 1/8 Watt 1% Resistor 240 Ohm 1/8 Watt 1% Resistor 330 Ohm 1/8 Watt 1% Resistor 390 Ohm 1/8 Watt 1% Resistor 470 Ohm 1/8 Watt 1% Resistor 1.0K Ohm 1/8 Watt 1% Resistor 1.5K Ohm 1/8 Watt 1% Resistor 2.0K Ohm 1/8 Watt 1% Resistor 4.7K Ohm 1/8 Watt 1% Resistor 5.1K Ohm 1/8 Watt 1% Resistor 5.6K Ohm 1/8 Watt 1% Resistor 10.0K Ohm 1/8 Watt 1% Resistor 22.0K Ohm 1/8 Watt 1% Resistor 33.0K Ohm 1/8 Watt 1% Resistor 100K Ohm 1/8 Watt 1% Resistor 1206 - 1206 Surface Mount Package 2012 - 2010 Surface Mount Package 0.11 Ohm 1/2 Watt 1% Resistor - Digikey: RHM.11UCT-ND; PARTNO: RC0603FR-07560RL
R3 R6 R11 R14 R19 R22 R27 R30 R35 R38 R43 R46 = keves-ng:RESISTOR: Resistors 0402 - 0402 Surface Mount Package 22 Ohm 1% 1/16W [Digikey: 311-22.0LRTR-ND] 33 Ohm 5% 1/16W 1.0K 5% 1/16W 1.5K 5% 1/16W 2.0K 1% 1/16W 10.0K 1% 1/16W [Digikey: 311-10.0KLRTR-ND] 10.0K 5% 1/16W [Digikey: RMCF0402JT10K0TR-ND] 12.1K 1% 1/16W [Digikey: 311-22.0LRTR-ND] 100.0K 5% 1/16W 0603 - 0603 Surface Mount Package 0 Ohm 1/10 Watt 1% Resistor 15 Ohm 1/10 Watt 1% Resistor 33 Ohm 1/10 Watt 1% Resistor 49.9 Ohm 1/10 Watt 1% Resistor 100 Ohm 1/10 Watt 1% Resistor 150 Ohm 1/10 Watt 1% Resistor 240 Ohm 1/10 Watt 1% Resistor 390 Ohm 1/10 Watt 1% Resistor 560 Ohm 1/10 Watt 1% Resistor 680 Ohm 1/10 Watt 1% Resistor 750 Ohm 1/10 Watt 1% Resistor 1.0K Ohm 1/10 Watt 1% Resistor 1.5K Ohm 1/10 Watt 1% Resistor 2.0K Ohm 1/10 Watt 1% Resistor 2.2K Ohm 1/10 Watt 1% Resistor 3.3K Ohm 1/10 Watt 1% Resistor 4.7K Ohm 1/10 Watt 1% Resistor 10.0K Ohm 1/10 Watt 1% Resistor 12.0K Ohm 1/10 Watt 1% Resistor 12.1K Ohm 1/10 Watt 1% Resistor 20.0K Ohm 1/10 Watt 1% Resistor 33.0K Ohm 1/10 Watt 1% Resistor 100.0K Ohm 1/10 Watt 1% Resistor 0805 - 0805 Surface Mount Package 0 Ohm 1/8 Watt 1% Resistor 33 Ohm 1/8 Watt 1% Resistor 100 Ohm 1/8 Watt 1% Resistor 150 Ohm 1/8 Watt 1% Resistor 200 Ohm 1/8 Watt 1% Resistor 240 Ohm 1/8 Watt 1% Resistor 330 Ohm 1/8 Watt 1% Resistor 390 Ohm 1/8 Watt 1% Resistor 470 Ohm 1/8 Watt 1% Resistor 1.0K Ohm 1/8 Watt 1% Resistor 1.5K Ohm 1/8 Watt 1% Resistor 2.0K Ohm 1/8 Watt 1% Resistor 4.7K Ohm 1/8 Watt 1% Resistor 5.1K Ohm 1/8 Watt 1% Resistor 5.6K Ohm 1/8 Watt 1% Resistor 10.0K Ohm 1/8 Watt 1% Resistor 22.0K Ohm 1/8 Watt 1% Resistor 33.0K Ohm 1/8 Watt 1% Resistor 100K Ohm 1/8 Watt 1% Resistor 1206 - 1206 Surface Mount Package 2012 - 2010 Surface Mount Package 0.11 Ohm 1/2 Watt 1% Resistor - Digikey: RHM.11UCT-ND; PARTNO: ERJ-3EKF8201V
R4 R7 R12 R15 R20 R23 R28 R31 R36 R39 R44 R47 = keves-ng:RESISTOR: Resistors 0402 - 0402 Surface Mount Package 22 Ohm 1% 1/16W [Digikey: 311-22.0LRTR-ND] 33 Ohm 5% 1/16W 1.0K 5% 1/16W 1.5K 5% 1/16W 2.0K 1% 1/16W 10.0K 1% 1/16W [Digikey: 311-10.0KLRTR-ND] 10.0K 5% 1/16W [Digikey: RMCF0402JT10K0TR-ND] 12.1K 1% 1/16W [Digikey: 311-22.0LRTR-ND] 100.0K 5% 1/16W 0603 - 0603 Surface Mount Package 0 Ohm 1/10 Watt 1% Resistor 15 Ohm 1/10 Watt 1% Resistor 33 Ohm 1/10 Watt 1% Resistor 49.9 Ohm 1/10 Watt 1% Resistor 100 Ohm 1/10 Watt 1% Resistor 150 Ohm 1/10 Watt 1% Resistor 240 Ohm 1/10 Watt 1% Resistor 390 Ohm 1/10 Watt 1% Resistor 560 Ohm 1/10 Watt 1% Resistor 680 Ohm 1/10 Watt 1% Resistor 750 Ohm 1/10 Watt 1% Resistor 1.0K Ohm 1/10 Watt 1% Resistor 1.5K Ohm 1/10 Watt 1% Resistor 2.0K Ohm 1/10 Watt 1% Resistor 2.2K Ohm 1/10 Watt 1% Resistor 3.3K Ohm 1/10 Watt 1% Resistor 4.7K Ohm 1/10 Watt 1% Resistor 10.0K Ohm 1/10 Watt 1% Resistor 12.0K Ohm 1/10 Watt 1% Resistor 12.1K Ohm 1/10 Watt 1% Resistor 20.0K Ohm 1/10 Watt 1% Resistor 33.0K Ohm 1/10 Watt 1% Resistor 100.0K Ohm 1/10 Watt 1% Resistor 0805 - 0805 Surface Mount Package 0 Ohm 1/8 Watt 1% Resistor 33 Ohm 1/8 Watt 1% Resistor 100 Ohm 1/8 Watt 1% Resistor 150 Ohm 1/8 Watt 1% Resistor 200 Ohm 1/8 Watt 1% Resistor 240 Ohm 1/8 Watt 1% Resistor 330 Ohm 1/8 Watt 1% Resistor 390 Ohm 1/8 Watt 1% Resistor 470 Ohm 1/8 Watt 1% Resistor 1.0K Ohm 1/8 Watt 1% Resistor 1.5K Ohm 1/8 Watt 1% Resistor 2.0K Ohm 1/8 Watt 1% Resistor 4.7K Ohm 1/8 Watt 1% Resistor 5.1K Ohm 1/8 Watt 1% Resistor 5.6K Ohm 1/8 Watt 1% Resistor 10.0K Ohm 1/8 Watt 1% Resistor 22.0K Ohm 1/8 Watt 1% Resistor 33.0K Ohm 1/8 Watt 1% Resistor 100K Ohm 1/8 Watt 1% Resistor 1206 - 1206 Surface Mount Package 2012 - 2010 Surface Mount Package 0.11 Ohm 1/2 Watt 1% Resistor - Digikey: RHM.11UCT-ND; PARTNO: RC0603FR-0751KL
R49 R98-R105 = keves-ng:RESISTOR: Resistors 0402 - 0402 Surface Mount Package 22 Ohm 1% 1/16W [Digikey: 311-22.0LRTR-ND] 33 Ohm 5% 1/16W 1.0K 5% 1/16W 1.5K 5% 1/16W 2.0K 1% 1/16W 10.0K 1% 1/16W [Digikey: 311-10.0KLRTR-ND] 10.0K 5% 1/16W [Digikey: RMCF0402JT10K0TR-ND] 12.1K 1% 1/16W [Digikey: 311-22.0LRTR-ND] 100.0K 5% 1/16W 0603 - 0603 Surface Mount Package 0 Ohm 1/10 Watt 1% Resistor 15 Ohm 1/10 Watt 1% Resistor 33 Ohm 1/10 Watt 1% Resistor 49.9 Ohm 1/10 Watt 1% Resistor 100 Ohm 1/10 Watt 1% Resistor 150 Ohm 1/10 Watt 1% Resistor 240 Ohm 1/10 Watt 1% Resistor 390 Ohm 1/10 Watt 1% Resistor 560 Ohm 1/10 Watt 1% Resistor 680 Ohm 1/10 Watt 1% Resistor 750 Ohm 1/10 Watt 1% Resistor 1.0K Ohm 1/10 Watt 1% Resistor 1.5K Ohm 1/10 Watt 1% Resistor 2.0K Ohm 1/10 Watt 1% Resistor 2.2K Ohm 1/10 Watt 1% Resistor 3.3K Ohm 1/10 Watt 1% Resistor 4.7K Ohm 1/10 Watt 1% Resistor 10.0K Ohm 1/10 Watt 1% Resistor 12.0K Ohm 1/10 Watt 1% Resistor 12.1K Ohm 1/10 Watt 1% Resistor 20.0K Ohm 1/10 Watt 1% Resistor 33.0K Ohm 1/10 Watt 1% Resistor 100.0K Ohm 1/10 Watt 1% Resistor 0805 - 0805 Surface Mount Package 0 Ohm 1/8 Watt 1% Resistor 33 Ohm 1/8 Watt 1% Resistor 100 Ohm 1/8 Watt 1% Resistor 150 Ohm 1/8 Watt 1% Resistor 200 Ohm 1/8 Watt 1% Resistor 240 Ohm 1/8 Watt 1% Resistor 330 Ohm 1/8 Watt 1% Resistor 390 Ohm 1/8 Watt 1% Resistor 470 Ohm 1/8 Watt 1% Resistor 1.0K Ohm 1/8 Watt 1% Resistor 1.5K Ohm 1/8 Watt 1% Resistor 2.0K Ohm 1/8 Watt 1% Resistor 4.7K Ohm 1/8 Watt 1% Resistor 5.1K Ohm 1/8 Watt 1% Resistor 5.6K Ohm 1/8 Watt 1% Resistor 10.0K Ohm 1/8 Watt 1% Resistor 22.0K Ohm 1/8 Watt 1% Resistor 33.0K Ohm 1/8 Watt 1% Resistor 100K Ohm 1/8 Watt 1% Resistor 1206 - 1206 Surface Mount Package 2012 - 2010 Surface Mount Package 0.11 Ohm 1/2 Watt 1% Resistor - Digikey: RHM.11UCT-ND; PARTNO: CRCW06031K00FKEAC
R50 R52 R55 = keves-ng:RESISTOR: Resistors 0402 - 0402 Surface Mount Package 22 Ohm 1% 1/16W [Digikey: 311-22.0LRTR-ND] 33 Ohm 5% 1/16W 1.0K 5% 1/16W 1.5K 5% 1/16W 2.0K 1% 1/16W 10.0K 1% 1/16W [Digikey: 311-10.0KLRTR-ND] 10.0K 5% 1/16W [Digikey: RMCF0402JT10K0TR-ND] 12.1K 1% 1/16W [Digikey: 311-22.0LRTR-ND] 100.0K 5% 1/16W 0603 - 0603 Surface Mount Package 0 Ohm 1/10 Watt 1% Resistor 15 Ohm 1/10 Watt 1% Resistor 33 Ohm 1/10 Watt 1% Resistor 49.9 Ohm 1/10 Watt 1% Resistor 100 Ohm 1/10 Watt 1% Resistor 150 Ohm 1/10 Watt 1% Resistor 240 Ohm 1/10 Watt 1% Resistor 390 Ohm 1/10 Watt 1% Resistor 560 Ohm 1/10 Watt 1% Resistor 680 Ohm 1/10 Watt 1% Resistor 750 Ohm 1/10 Watt 1% Resistor 1.0K Ohm 1/10 Watt 1% Resistor 1.5K Ohm 1/10 Watt 1% Resistor 2.0K Ohm 1/10 Watt 1% Resistor 2.2K Ohm 1/10 Watt 1% Resistor 3.3K Ohm 1/10 Watt 1% Resistor 4.7K Ohm 1/10 Watt 1% Resistor 10.0K Ohm 1/10 Watt 1% Resistor 12.0K Ohm 1/10 Watt 1% Resistor 12.1K Ohm 1/10 Watt 1% Resistor 20.0K Ohm 1/10 Watt 1% Resistor 33.0K Ohm 1/10 Watt 1% Resistor 100.0K Ohm 1/10 Watt 1% Resistor 0805 - 0805 Surface Mount Package 0 Ohm 1/8 Watt 1% Resistor 33 Ohm 1/8 Watt 1% Resistor 100 Ohm 1/8 Watt 1% Resistor 150 Ohm 1/8 Watt 1% Resistor 200 Ohm 1/8 Watt 1% Resistor 240 Ohm 1/8 Watt 1% Resistor 330 Ohm 1/8 Watt 1% Resistor 390 Ohm 1/8 Watt 1% Resistor 470 Ohm 1/8 Watt 1% Resistor 1.0K Ohm 1/8 Watt 1% Resistor 1.5K Ohm 1/8 Watt 1% Resistor 2.0K Ohm 1/8 Watt 1% Resistor 4.7K Ohm 1/8 Watt 1% Resistor 5.1K Ohm 1/8 Watt 1% Resistor 5.6K Ohm 1/8 Watt 1% Resistor 10.0K Ohm 1/8 Watt 1% Resistor 22.0K Ohm 1/8 Watt 1% Resistor 33.0K Ohm 1/8 Watt 1% Resistor 100K Ohm 1/8 Watt 1% Resistor 1206 - 1206 Surface Mount Package 2012 - 2010 Surface Mount Package 0.11 Ohm 1/2 Watt 1% Resistor - Digikey: RHM.11UCT-ND; PARTNO: CRCW060310K0JNEBC
R51 R53 = keves-ng:RESISTOR: Resistors 0402 - 0402 Surface Mount Package 22 Ohm 1% 1/16W [Digikey: 311-22.0LRTR-ND] 33 Ohm 5% 1/16W 1.0K 5% 1/16W 1.5K 5% 1/16W 2.0K 1% 1/16W 10.0K 1% 1/16W [Digikey: 311-10.0KLRTR-ND] 10.0K 5% 1/16W [Digikey: RMCF0402JT10K0TR-ND] 12.1K 1% 1/16W [Digikey: 311-22.0LRTR-ND] 100.0K 5% 1/16W 0603 - 0603 Surface Mount Package 0 Ohm 1/10 Watt 1% Resistor 15 Ohm 1/10 Watt 1% Resistor 33 Ohm 1/10 Watt 1% Resistor 49.9 Ohm 1/10 Watt 1% Resistor 100 Ohm 1/10 Watt 1% Resistor 150 Ohm 1/10 Watt 1% Resistor 240 Ohm 1/10 Watt 1% Resistor 390 Ohm 1/10 Watt 1% Resistor 560 Ohm 1/10 Watt 1% Resistor 680 Ohm 1/10 Watt 1% Resistor 750 Ohm 1/10 Watt 1% Resistor 1.0K Ohm 1/10 Watt 1% Resistor 1.5K Ohm 1/10 Watt 1% Resistor 2.0K Ohm 1/10 Watt 1% Resistor 2.2K Ohm 1/10 Watt 1% Resistor 3.3K Ohm 1/10 Watt 1% Resistor 4.7K Ohm 1/10 Watt 1% Resistor 10.0K Ohm 1/10 Watt 1% Resistor 12.0K Ohm 1/10 Watt 1% Resistor 12.1K Ohm 1/10 Watt 1% Resistor 20.0K Ohm 1/10 Watt 1% Resistor 33.0K Ohm 1/10 Watt 1% Resistor 100.0K Ohm 1/10 Watt 1% Resistor 0805 - 0805 Surface Mount Package 0 Ohm 1/8 Watt 1% Resistor 33 Ohm 1/8 Watt 1% Resistor 100 Ohm 1/8 Watt 1% Resistor 150 Ohm 1/8 Watt 1% Resistor 200 Ohm 1/8 Watt 1% Resistor 240 Ohm 1/8 Watt 1% Resistor 330 Ohm 1/8 Watt 1% Resistor 390 Ohm 1/8 Watt 1% Resistor 470 Ohm 1/8 Watt 1% Resistor 1.0K Ohm 1/8 Watt 1% Resistor 1.5K Ohm 1/8 Watt 1% Resistor 2.0K Ohm 1/8 Watt 1% Resistor 4.7K Ohm 1/8 Watt 1% Resistor 5.1K Ohm 1/8 Watt 1% Resistor 5.6K Ohm 1/8 Watt 1% Resistor 10.0K Ohm 1/8 Watt 1% Resistor 22.0K Ohm 1/8 Watt 1% Resistor 33.0K Ohm 1/8 Watt 1% Resistor 100K Ohm 1/8 Watt 1% Resistor 1206 - 1206 Surface Mount Package 2012 - 2010 Surface Mount Package 0.11 Ohm 1/2 Watt 1% Resistor - Digikey: RHM.11UCT-ND; DNP: T; PARTNO: CRCW060310K0JNEBC
R54 = keves-ng:RESISTOR: Resistors 0402 - 0402 Surface Mount Package 22 Ohm 1% 1/16W [Digikey: 311-22.0LRTR-ND] 33 Ohm 5% 1/16W 1.0K 5% 1/16W 1.5K 5% 1/16W 2.0K 1% 1/16W 10.0K 1% 1/16W [Digikey: 311-10.0KLRTR-ND] 10.0K 5% 1/16W [Digikey: RMCF0402JT10K0TR-ND] 12.1K 1% 1/16W [Digikey: 311-22.0LRTR-ND] 100.0K 5% 1/16W 0603 - 0603 Surface Mount Package 0 Ohm 1/10 Watt 1% Resistor 15 Ohm 1/10 Watt 1% Resistor 33 Ohm 1/10 Watt 1% Resistor 49.9 Ohm 1/10 Watt 1% Resistor 100 Ohm 1/10 Watt 1% Resistor 150 Ohm 1/10 Watt 1% Resistor 240 Ohm 1/10 Watt 1% Resistor 390 Ohm 1/10 Watt 1% Resistor 560 Ohm 1/10 Watt 1% Resistor 680 Ohm 1/10 Watt 1% Resistor 750 Ohm 1/10 Watt 1% Resistor 1.0K Ohm 1/10 Watt 1% Resistor 1.5K Ohm 1/10 Watt 1% Resistor 2.0K Ohm 1/10 Watt 1% Resistor 2.2K Ohm 1/10 Watt 1% Resistor 3.3K Ohm 1/10 Watt 1% Resistor 4.7K Ohm 1/10 Watt 1% Resistor 10.0K Ohm 1/10 Watt 1% Resistor 12.0K Ohm 1/10 Watt 1% Resistor 12.1K Ohm 1/10 Watt 1% Resistor 20.0K Ohm 1/10 Watt 1% Resistor 33.0K Ohm 1/10 Watt 1% Resistor 100.0K Ohm 1/10 Watt 1% Resistor 0805 - 0805 Surface Mount Package 0 Ohm 1/8 Watt 1% Resistor 33 Ohm 1/8 Watt 1% Resistor 100 Ohm 1/8 Watt 1% Resistor 150 Ohm 1/8 Watt 1% Resistor 200 Ohm 1/8 Watt 1% Resistor 240 Ohm 1/8 Watt 1% Resistor 330 Ohm 1/8 Watt 1% Resistor 390 Ohm 1/8 Watt 1% Resistor 470 Ohm 1/8 Watt 1% Resistor 1.0K Ohm 1/8 Watt 1% Resistor 1.5K Ohm 1/8 Watt 1% Resistor 2.0K Ohm 1/8 Watt 1% Resistor 4.7K Ohm 1/8 Watt 1% Resistor 5.1K Ohm 1/8 Watt 1% Resistor 5.6K Ohm 1/8 Watt 1% Resistor 10.0K Ohm 1/8 Watt 1% Resistor 22.0K Ohm 1/8 Watt 1% Resistor 33.0K Ohm 1/8 Watt 1% Resistor 100K Ohm 1/8 Watt 1% Resistor 1206 - 1206 Surface Mount Package 2012 - 2010 Surface Mount Package 0.11 Ohm 1/2 Watt 1% Resistor - Digikey: RHM.11UCT-ND; PARTNO: AF0603FR-073KL
R56 R59-R64 R66 R67 R69-R71 R75 R76 R78-R82 = keves-ng:RESISTOR: Resistors 0402 - 0402 Surface Mount Package 22 Ohm 1% 1/16W [Digikey: 311-22.0LRTR-ND] 33 Ohm 5% 1/16W 1.0K 5% 1/16W 1.5K 5% 1/16W 2.0K 1% 1/16W 10.0K 1% 1/16W [Digikey: 311-10.0KLRTR-ND] 10.0K 5% 1/16W [Digikey: RMCF0402JT10K0TR-ND] 12.1K 1% 1/16W [Digikey: 311-22.0LRTR-ND] 100.0K 5% 1/16W 0603 - 0603 Surface Mount Package 0 Ohm 1/10 Watt 1% Resistor 15 Ohm 1/10 Watt 1% Resistor 33 Ohm 1/10 Watt 1% Resistor 49.9 Ohm 1/10 Watt 1% Resistor 100 Ohm 1/10 Watt 1% Resistor 150 Ohm 1/10 Watt 1% Resistor 240 Ohm 1/10 Watt 1% Resistor 390 Ohm 1/10 Watt 1% Resistor 560 Ohm 1/10 Watt 1% Resistor 680 Ohm 1/10 Watt 1% Resistor 750 Ohm 1/10 Watt 1% Resistor 1.0K Ohm 1/10 Watt 1% Resistor 1.5K Ohm 1/10 Watt 1% Resistor 2.0K Ohm 1/10 Watt 1% Resistor 2.2K Ohm 1/10 Watt 1% Resistor 3.3K Ohm 1/10 Watt 1% Resistor 4.7K Ohm 1/10 Watt 1% Resistor 10.0K Ohm 1/10 Watt 1% Resistor 12.0K Ohm 1/10 Watt 1% Resistor 12.1K Ohm 1/10 Watt 1% Resistor 20.0K Ohm 1/10 Watt 1% Resistor 33.0K Ohm 1/10 Watt 1% Resistor 100.0K Ohm 1/10 Watt 1% Resistor 0805 - 0805 Surface Mount Package 0 Ohm 1/8 Watt 1% Resistor 33 Ohm 1/8 Watt 1% Resistor 100 Ohm 1/8 Watt 1% Resistor 150 Ohm 1/8 Watt 1% Resistor 200 Ohm 1/8 Watt 1% Resistor 240 Ohm 1/8 Watt 1% Resistor 330 Ohm 1/8 Watt 1% Resistor 390 Ohm 1/8 Watt 1% Resistor 470 Ohm 1/8 Watt 1% Resistor 1.0K Ohm 1/8 Watt 1% Resistor 1.5K Ohm 1/8 Watt 1% Resistor 2.0K Ohm 1/8 Watt 1% Resistor 4.7K Ohm 1/8 Watt 1% Resistor 5.1K Ohm 1/8 Watt 1% Resistor 5.6K Ohm 1/8 Watt 1% Resistor 10.0K Ohm 1/8 Watt 1% Resistor 22.0K Ohm 1/8 Watt 1% Resistor 33.0K Ohm 1/8 Watt 1% Resistor 100K Ohm 1/8 Watt 1% Resistor 1206 - 1206 Surface Mount Package 2012 - 2010 Surface Mount Package 0.11 Ohm 1/2 Watt 1% Resistor - Digikey: RHM.11UCT-ND; PARTNO: CRCW06030000Z0EBC
R57 R58 = keves-ng:RESISTOR: Resistors 0402 - 0402 Surface Mount Package 22 Ohm 1% 1/16W [Digikey: 311-22.0LRTR-ND] 33 Ohm 5% 1/16W 1.0K 5% 1/16W 1.5K 5% 1/16W 2.0K 1% 1/16W 10.0K 1% 1/16W [Digikey: 311-10.0KLRTR-ND] 10.0K 5% 1/16W [Digikey: RMCF0402JT10K0TR-ND] 12.1K 1% 1/16W [Digikey: 311-22.0LRTR-ND] 100.0K 5% 1/16W 0603 - 0603 Surface Mount Package 0 Ohm 1/10 Watt 1% Resistor 15 Ohm 1/10 Watt 1% Resistor 33 Ohm 1/10 Watt 1% Resistor 49.9 Ohm 1/10 Watt 1% Resistor 100 Ohm 1/10 Watt 1% Resistor 150 Ohm 1/10 Watt 1% Resistor 240 Ohm 1/10 Watt 1% Resistor 390 Ohm 1/10 Watt 1% Resistor 560 Ohm 1/10 Watt 1% Resistor 680 Ohm 1/10 Watt 1% Resistor 750 Ohm 1/10 Watt 1% Resistor 1.0K Ohm 1/10 Watt 1% Resistor 1.5K Ohm 1/10 Watt 1% Resistor 2.0K Ohm 1/10 Watt 1% Resistor 2.2K Ohm 1/10 Watt 1% Resistor 3.3K Ohm 1/10 Watt 1% Resistor 4.7K Ohm 1/10 Watt 1% Resistor 10.0K Ohm 1/10 Watt 1% Resistor 12.0K Ohm 1/10 Watt 1% Resistor 12.1K Ohm 1/10 Watt 1% Resistor 20.0K Ohm 1/10 Watt 1% Resistor 33.0K Ohm 1/10 Watt 1% Resistor 100.0K Ohm 1/10 Watt 1% Resistor 0805 - 0805 Surface Mount Package 0 Ohm 1/8 Watt 1% Resistor 33 Ohm 1/8 Watt 1% Resistor 100 Ohm 1/8 Watt 1% Resistor 150 Ohm 1/8 Watt 1% Resistor 200 Ohm 1/8 Watt 1% Resistor 240 Ohm 1/8 Watt 1% Resistor 330 Ohm 1/8 Watt 1% Resistor 390 Ohm 1/8 Watt 1% Resistor 470 Ohm 1/8 Watt 1% Resistor 1.0K Ohm 1/8 Watt 1% Resistor 1.5K Ohm 1/8 Watt 1% Resistor 2.0K Ohm 1/8 Watt 1% Resistor 4.7K Ohm 1/8 Watt 1% Resistor 5.1K Ohm 1/8 Watt 1% Resistor 5.6K Ohm 1/8 Watt 1% Resistor 10.0K Ohm 1/8 Watt 1% Resistor 22.0K Ohm 1/8 Watt 1% Resistor 33.0K Ohm 1/8 Watt 1% Resistor 100K Ohm 1/8 Watt 1% Resistor 1206 - 1206 Surface Mount Package 2012 - 2010 Surface Mount Package 0.11 Ohm 1/2 Watt 1% Resistor - Digikey: RHM.11UCT-ND; PARTNO: AC0603FR-131ML
R65 R68 R72-R74 R77 R83-R86 R88-R91 = keves-ng:RESISTOR: Resistors 0402 - 0402 Surface Mount Package 22 Ohm 1% 1/16W [Digikey: 311-22.0LRTR-ND] 33 Ohm 5% 1/16W 1.0K 5% 1/16W 1.5K 5% 1/16W 2.0K 1% 1/16W 10.0K 1% 1/16W [Digikey: 311-10.0KLRTR-ND] 10.0K 5% 1/16W [Digikey: RMCF0402JT10K0TR-ND] 12.1K 1% 1/16W [Digikey: 311-22.0LRTR-ND] 100.0K 5% 1/16W 0603 - 0603 Surface Mount Package 0 Ohm 1/10 Watt 1% Resistor 15 Ohm 1/10 Watt 1% Resistor 33 Ohm 1/10 Watt 1% Resistor 49.9 Ohm 1/10 Watt 1% Resistor 100 Ohm 1/10 Watt 1% Resistor 150 Ohm 1/10 Watt 1% Resistor 240 Ohm 1/10 Watt 1% Resistor 390 Ohm 1/10 Watt 1% Resistor 560 Ohm 1/10 Watt 1% Resistor 680 Ohm 1/10 Watt 1% Resistor 750 Ohm 1/10 Watt 1% Resistor 1.0K Ohm 1/10 Watt 1% Resistor 1.5K Ohm 1/10 Watt 1% Resistor 2.0K Ohm 1/10 Watt 1% Resistor 2.2K Ohm 1/10 Watt 1% Resistor 3.3K Ohm 1/10 Watt 1% Resistor 4.7K Ohm 1/10 Watt 1% Resistor 10.0K Ohm 1/10 Watt 1% Resistor 12.0K Ohm 1/10 Watt 1% Resistor 12.1K Ohm 1/10 Watt 1% Resistor 20.0K Ohm 1/10 Watt 1% Resistor 33.0K Ohm 1/10 Watt 1% Resistor 100.0K Ohm 1/10 Watt 1% Resistor 0805 - 0805 Surface Mount Package 0 Ohm 1/8 Watt 1% Resistor 33 Ohm 1/8 Watt 1% Resistor 100 Ohm 1/8 Watt 1% Resistor 150 Ohm 1/8 Watt 1% Resistor 200 Ohm 1/8 Watt 1% Resistor 240 Ohm 1/8 Watt 1% Resistor 330 Ohm 1/8 Watt 1% Resistor 390 Ohm 1/8 Watt 1% Resistor 470 Ohm 1/8 Watt 1% Resistor 1.0K Ohm 1/8 Watt 1% Resistor 1.5K Ohm 1/8 Watt 1% Resistor 2.0K Ohm 1/8 Watt 1% Resistor 4.7K Ohm 1/8 Watt 1% Resistor 5.1K Ohm 1/8 Watt 1% Resistor 5.6K Ohm 1/8 Watt 1% Resistor 10.0K Ohm 1/8 Watt 1% Resistor 22.0K Ohm 1/8 Watt 1% Resistor 33.0K Ohm 1/8 Watt 1% Resistor 100K Ohm 1/8 Watt 1% Resistor 1206 - 1206 Surface Mount Package 2012 - 2010 Surface Mount Package 0.11 Ohm 1/2 Watt 1% Resistor - Digikey: RHM.11UCT-ND; PARTNO: CRCW060322R0FKEAC
R92 R93 = keves-ng:RESISTOR: Resistors 0402 - 0402 Surface Mount Package 22 Ohm 1% 1/16W [Digikey: 311-22.0LRTR-ND] 33 Ohm 5% 1/16W 1.0K 5% 1/16W 1.5K 5% 1/16W 2.0K 1% 1/16W 10.0K 1% 1/16W [Digikey: 311-10.0KLRTR-ND] 10.0K 5% 1/16W [Digikey: RMCF0402JT10K0TR-ND] 12.1K 1% 1/16W [Digikey: 311-22.0LRTR-ND] 100.0K 5% 1/16W 0603 - 0603 Surface Mount Package 0 Ohm 1/10 Watt 1% Resistor 15 Ohm 1/10 Watt 1% Resistor 33 Ohm 1/10 Watt 1% Resistor 49.9 Ohm 1/10 Watt 1% Resistor 100 Ohm 1/10 Watt 1% Resistor 150 Ohm 1/10 Watt 1% Resistor 240 Ohm 1/10 Watt 1% Resistor 390 Ohm 1/10 Watt 1% Resistor 560 Ohm 1/10 Watt 1% Resistor 680 Ohm 1/10 Watt 1% Resistor 750 Ohm 1/10 Watt 1% Resistor 1.0K Ohm 1/10 Watt 1% Resistor 1.5K Ohm 1/10 Watt 1% Resistor 2.0K Ohm 1/10 Watt 1% Resistor 2.2K Ohm 1/10 Watt 1% Resistor 3.3K Ohm 1/10 Watt 1% Resistor 4.7K Ohm 1/10 Watt 1% Resistor 10.0K Ohm 1/10 Watt 1% Resistor 12.0K Ohm 1/10 Watt 1% Resistor 12.1K Ohm 1/10 Watt 1% Resistor 20.0K Ohm 1/10 Watt 1% Resistor 33.0K Ohm 1/10 Watt 1% Resistor 100.0K Ohm 1/10 Watt 1% Resistor 0805 - 0805 Surface Mount Package 0 Ohm 1/8 Watt 1% Resistor 33 Ohm 1/8 Watt 1% Resistor 100 Ohm 1/8 Watt 1% Resistor 150 Ohm 1/8 Watt 1% Resistor 200 Ohm 1/8 Watt 1% Resistor 240 Ohm 1/8 Watt 1% Resistor 330 Ohm 1/8 Watt 1% Resistor 390 Ohm 1/8 Watt 1% Resistor 470 Ohm 1/8 Watt 1% Resistor 1.0K Ohm 1/8 Watt 1% Resistor 1.5K Ohm 1/8 Watt 1% Resistor 2.0K Ohm 1/8 Watt 1% Resistor 4.7K Ohm 1/8 Watt 1% Resistor 5.1K Ohm 1/8 Watt 1% Resistor 5.6K Ohm 1/8 Watt 1% Resistor 10.0K Ohm 1/8 Watt 1% Resistor 22.0K Ohm 1/8 Watt 1% Resistor 33.0K Ohm 1/8 Watt 1% Resistor 100K Ohm 1/8 Watt 1% Resistor 1206 - 1206 Surface Mount Package 2012 - 2010 Surface Mount Package 0.11 Ohm 1/2 Watt 1% Resistor - Digikey: RHM.11UCT-ND; PARTNO: CRCW06034K70FKEA
R94 R97 = keves-ng:RESISTOR: Resistors 0402 - 0402 Surface Mount Package 22 Ohm 1% 1/16W [Digikey: 311-22.0LRTR-ND] 33 Ohm 5% 1/16W 1.0K 5% 1/16W 1.5K 5% 1/16W 2.0K 1% 1/16W 10.0K 1% 1/16W [Digikey: 311-10.0KLRTR-ND] 10.0K 5% 1/16W [Digikey: RMCF0402JT10K0TR-ND] 12.1K 1% 1/16W [Digikey: 311-22.0LRTR-ND] 100.0K 5% 1/16W 0603 - 0603 Surface Mount Package 0 Ohm 1/10 Watt 1% Resistor 15 Ohm 1/10 Watt 1% Resistor 33 Ohm 1/10 Watt 1% Resistor 49.9 Ohm 1/10 Watt 1% Resistor 100 Ohm 1/10 Watt 1% Resistor 150 Ohm 1/10 Watt 1% Resistor 240 Ohm 1/10 Watt 1% Resistor 390 Ohm 1/10 Watt 1% Resistor 560 Ohm 1/10 Watt 1% Resistor 680 Ohm 1/10 Watt 1% Resistor 750 Ohm 1/10 Watt 1% Resistor 1.0K Ohm 1/10 Watt 1% Resistor 1.5K Ohm 1/10 Watt 1% Resistor 2.0K Ohm 1/10 Watt 1% Resistor 2.2K Ohm 1/10 Watt 1% Resistor 3.3K Ohm 1/10 Watt 1% Resistor 4.7K Ohm 1/10 Watt 1% Resistor 10.0K Ohm 1/10 Watt 1% Resistor 12.0K Ohm 1/10 Watt 1% Resistor 12.1K Ohm 1/10 Watt 1% Resistor 20.0K Ohm 1/10 Watt 1% Resistor 33.0K Ohm 1/10 Watt 1% Resistor 100.0K Ohm 1/10 Watt 1% Resistor 0805 - 0805 Surface Mount Package 0 Ohm 1/8 Watt 1% Resistor 33 Ohm 1/8 Watt 1% Resistor 100 Ohm 1/8 Watt 1% Resistor 150 Ohm 1/8 Watt 1% Resistor 200 Ohm 1/8 Watt 1% Resistor 240 Ohm 1/8 Watt 1% Resistor 330 Ohm 1/8 Watt 1% Resistor 390 Ohm 1/8 Watt 1% Resistor 470 Ohm 1/8 Watt 1% Resistor 1.0K Ohm 1/8 Watt 1% Resistor 1.5K Ohm 1/8 Watt 1% Resistor 2.0K Ohm 1/8 Watt 1% Resistor 4.7K Ohm 1/8 Watt 1% Resistor 5.1K Ohm 1/8 Watt 1% Resistor 5.6K Ohm 1/8 Watt 1% Resistor 10.0K Ohm 1/8 Watt 1% Resistor 22.0K Ohm 1/8 Watt 1% Resistor 33.0K Ohm 1/8 Watt 1% Resistor 100K Ohm 1/8 Watt 1% Resistor 1206 - 1206 Surface Mount Package 2012 - 2010 Surface Mount Package 0.11 Ohm 1/2 Watt 1% Resistor - Digikey: RHM.11UCT-ND; PARTNO: ERA-3AEB241V
R95 R96 = keves-ng:RESISTOR: Resistors 0402 - 0402 Surface Mount Package 22 Ohm 1% 1/16W [Digikey: 311-22.0LRTR-ND] 33 Ohm 5% 1/16W 1.0K 5% 1/16W 1.5K 5% 1/16W 2.0K 1% 1/16W 10.0K 1% 1/16W [Digikey: 311-10.0KLRTR-ND] 10.0K 5% 1/16W [Digikey: RMCF0402JT10K0TR-ND] 12.1K 1% 1/16W [Digikey: 311-22.0LRTR-ND] 100.0K 5% 1/16W 0603 - 0603 Surface Mount Package 0 Ohm 1/10 Watt 1% Resistor 15 Ohm 1/10 Watt 1% Resistor 33 Ohm 1/10 Watt 1% Resistor 49.9 Ohm 1/10 Watt 1% Resistor 100 Ohm 1/10 Watt 1% Resistor 150 Ohm 1/10 Watt 1% Resistor 240 Ohm 1/10 Watt 1% Resistor 390 Ohm 1/10 Watt 1% Resistor 560 Ohm 1/10 Watt 1% Resistor 680 Ohm 1/10 Watt 1% Resistor 750 Ohm 1/10 Watt 1% Resistor 1.0K Ohm 1/10 Watt 1% Resistor 1.5K Ohm 1/10 Watt 1% Resistor 2.0K Ohm 1/10 Watt 1% Resistor 2.2K Ohm 1/10 Watt 1% Resistor 3.3K Ohm 1/10 Watt 1% Resistor 4.7K Ohm 1/10 Watt 1% Resistor 10.0K Ohm 1/10 Watt 1% Resistor 12.0K Ohm 1/10 Watt 1% Resistor 12.1K Ohm 1/10 Watt 1% Resistor 20.0K Ohm 1/10 Watt 1% Resistor 33.0K Ohm 1/10 Watt 1% Resistor 100.0K Ohm 1/10 Watt 1% Resistor 0805 - 0805 Surface Mount Package 0 Ohm 1/8 Watt 1% Resistor 33 Ohm 1/8 Watt 1% Resistor 100 Ohm 1/8 Watt 1% Resistor 150 Ohm 1/8 Watt 1% Resistor 200 Ohm 1/8 Watt 1% Resistor 240 Ohm 1/8 Watt 1% Resistor 330 Ohm 1/8 Watt 1% Resistor 390 Ohm 1/8 Watt 1% Resistor 470 Ohm 1/8 Watt 1% Resistor 1.0K Ohm 1/8 Watt 1% Resistor 1.5K Ohm 1/8 Watt 1% Resistor 2.0K Ohm 1/8 Watt 1% Resistor 4.7K Ohm 1/8 Watt 1% Resistor 5.1K Ohm 1/8 Watt 1% Resistor 5.6K Ohm 1/8 Watt 1% Resistor 10.0K Ohm 1/8 Watt 1% Resistor 22.0K Ohm 1/8 Watt 1% Resistor 33.0K Ohm 1/8 Watt 1% Resistor 100K Ohm 1/8 Watt 1% Resistor 1206 - 1206 Surface Mount Package 2012 - 2010 Surface Mount Package 0.11 Ohm 1/2 Watt 1% Resistor - Digikey: RHM.11UCT-ND; PARTNO: ERA-3VEB2201V
TC1 = TagConnect:TC2050-IDC: Tag-Connect In Circuit Programming & Debug Cable 10 Pin http://www.tag-connect.com; BOM: EXCLUDE; DNP: T; POPULATE: 0
TP1-TP5 TP7-TP10 TP16-TP18 = keves-ng:TP: Test pad; PARTNO: 5001
U1 = keves-ng:LM1117: LM1117 Voltage Regulator LM1117 Adjustable Voltage regulator [Digikey: LM1117IMP-ADJDKR-ND] LM1117 3.3V Voltage regulator [AP1117E33GDIDKR-ND] LM1117 5.0V Voltage regulator [AP1117E50GDIDKR-ND] SOT223-REFLOW - SOT223 package for solder paste/reflow ovens SOT223-WAVE - SOT223 package for hand-soldering (larger pads) Note: For the fixed-voltage regulators, simply set the ADJ pin to GND.; PARTNO: LM1117DTX-3.3/NOPB
U2 = keves-ng:PCN2-S5-D12-S; MANUFACTURER: CUI INC; PARTNO: PCN2-S5-D15-S; PARTREV: 1.0; STANDARD: MANUFACTURER RECOMMENDATIONS
U3 = keves-ng:STM32F7X3ZXT; COPYRIGHT: Copyright (C) 2016 Accelerated Designs. All rights reserved; MANUFACTURER_PART_NUMBER: STM32F7X3ZXT; PARTNO: STM32F733ZET6; VENDOR: STMicroelectronics
U4 U5 = keves-ng:USBLC6-2SC6Y; BUILT_BY: EMA_UL_Team; MANUFACTURER_PART_NUMBER: USBLC6-2SC6Y; PARTNO: USBLC6-2SC6Y; SOURCELIBRARY: StMicro_2015-03-30; VENDOR: STMicroelectronics
U6 U7 = keves-ng:PCM1681PWP; DATASHEET_URL: http://www.ti.com/lit/gpn/PCM1681; DESCRIPTION: 105dB SNR 8-Channel Audio DAC with TDM Mode; FAMILY_NAME: DIGITAL TO ANALOG; GENERIC_PART_NUMBER: PCM1681; INDUSTRY_STD_PKG_TYPE: HTSSOP; MANUFACTURER: Texas Instruments; MANUFACTURER_PART_NUMBER: PCM1681PWP; PACKAGE_DESIGNATOR: PWP; PARTNO: PCM1681PWP; PIN_COUNT: 28; VENDOR: Texas Instruments
U$1 = keves-ng:WBL2UOAGQR05CLR: right angle illuminated pushbutton; PARTNO: WBL2UOAGQR05CLR
U$2 = keves-ng:PHI-LOGO; BOM: EXCLUDE; DNP: T
USB_FS = keves-ng:TE-292304-1: USB A Female connector; MPN: 292304-1; PARTNO: 292304-1
USB_HS = keves-ng:FCI-73725-0110BLF; PARTNO: 73725-0110BLF
Y1 = keves-ng:CRYSTAL: Crystals HC49UP - Surface Mount Crystal 4.0MHz 18pF +/-30ppm Surface Mount Crystal [Digikey: 535-9857-1-ND] 12.0 MHz Surface Mount Crystal [Digikey: 535-9869-6-ND] 25.0 MHz Surface Mount Crystal [Digikey: 535-9078-1-ND] 2.5 x 2.0mm - MEMs SMT Crystal 16.0 MHz 10pF 20ppm 2.5 x 2.0mm Crystal [Digikey -40-85°C: 535-10923-1-ND] 3.2 x 2.5mm - MEMs SMT Crystal 12.0 MHz 8pF 15ppm 3.2 x 2.5mm Crystal [Digikey: -10-70°C: 644-1047-1-ND -40-125°C: 644-1128-1-ND] 16.0 MHz 8pF 15ppm 3.2 x 2.5mm Crystal [Digikey: -10-70°C: 644-1049-1-ND -40-125°C: 644-1129-2-ND] 16.0 MHz 10pF 10ppm 3.2 x 2.5mm Crystal [Digikey: 644-1100-1-ND] 27.12 MHz 18pF 30ppm 3.2 x 2.5mm Crystal [Digikey: 887-1424-1-ND] 27.12MHz 10pF 10ppm 3.2 x 2.5mm Crystal [Digikey: 887-1329-1-ND] 4.9 x 1.8mm - MEMs SMT Crystal 32.768 KHz 12.5pF 20ppm 4.9 x 1.8mm Crystal [Digikey: SE2415CT-ND] 8.0 x 3.8mm - Surface Mount Crystal 32.768kHz 12.5pF 20ppm -40°C-85°C [Digikey: 535-9166-2-ND] Cylinder 32.768KHz Cylinder Crystal (2x6mm body) [Ex. Digikey: 300-8341-2-ND]; PARTNO: ABLS7M2-25.000MHZ-D2Y-T

## Net classes
1 USB: width 0.152 mm, clearance 0.152 mm